# EAGLE design usb_hub_test (EAGLE 7.2.0)

## Sheet 1 of 7: USB Input
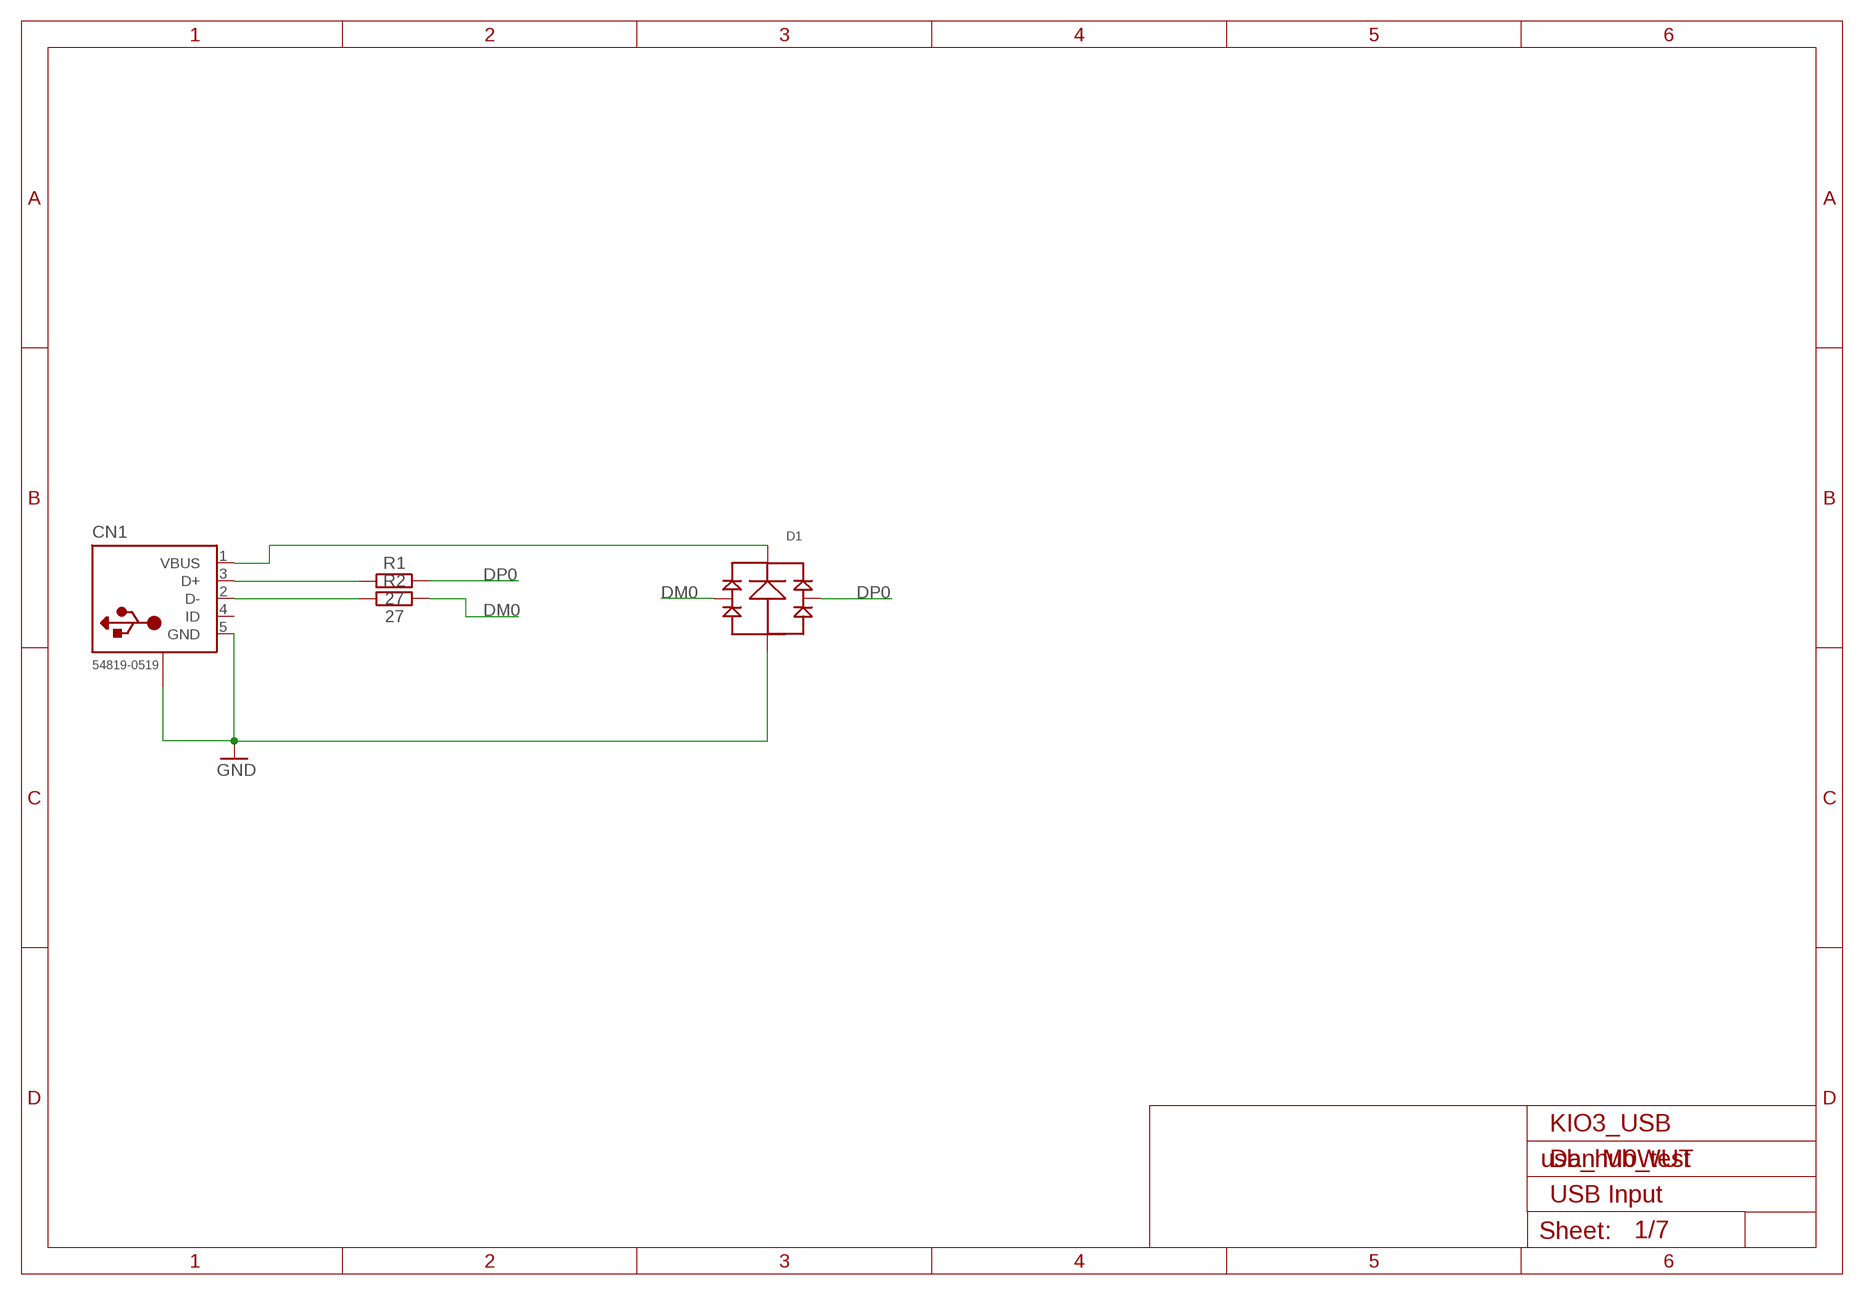
[diagram p0: schematic, sheet 1]

### Parts
CN1  54819-0519  USBMUSB  [CONN_AMP_MUSB_K152]
D1  D_ST_USBULC6  [UQFN6]
R1  27  R-EU_R0402  [R0402]
R2  27  R-EU_R0402  [R0402]

### Nets
D+_P: CN1.3(D+) R1.1
DM0: D1.1(LEFT) D1.6(LEFT) R2.2 ; also sheet 2
DP0: D1.3(RIGHT) D1.4(RIGHT) R1.2 ; also sheet 2
GND: CN1.5(GND) CN1.GND1(SHIELD) CN1.GND2(SHIELD) D1.2(GND) ; also sheet 2,3,4,5,6,7
N$20: CN1.2(D-) R2.1
VBUS: CN1.1(VBUS) D1.5(V+)
Unconnected: CN1.4(ID)

### Notes on the sheet
- KIO3_USB
- Dan M0WUT
- USB Input

## Sheet 2 of 7: USB Hub
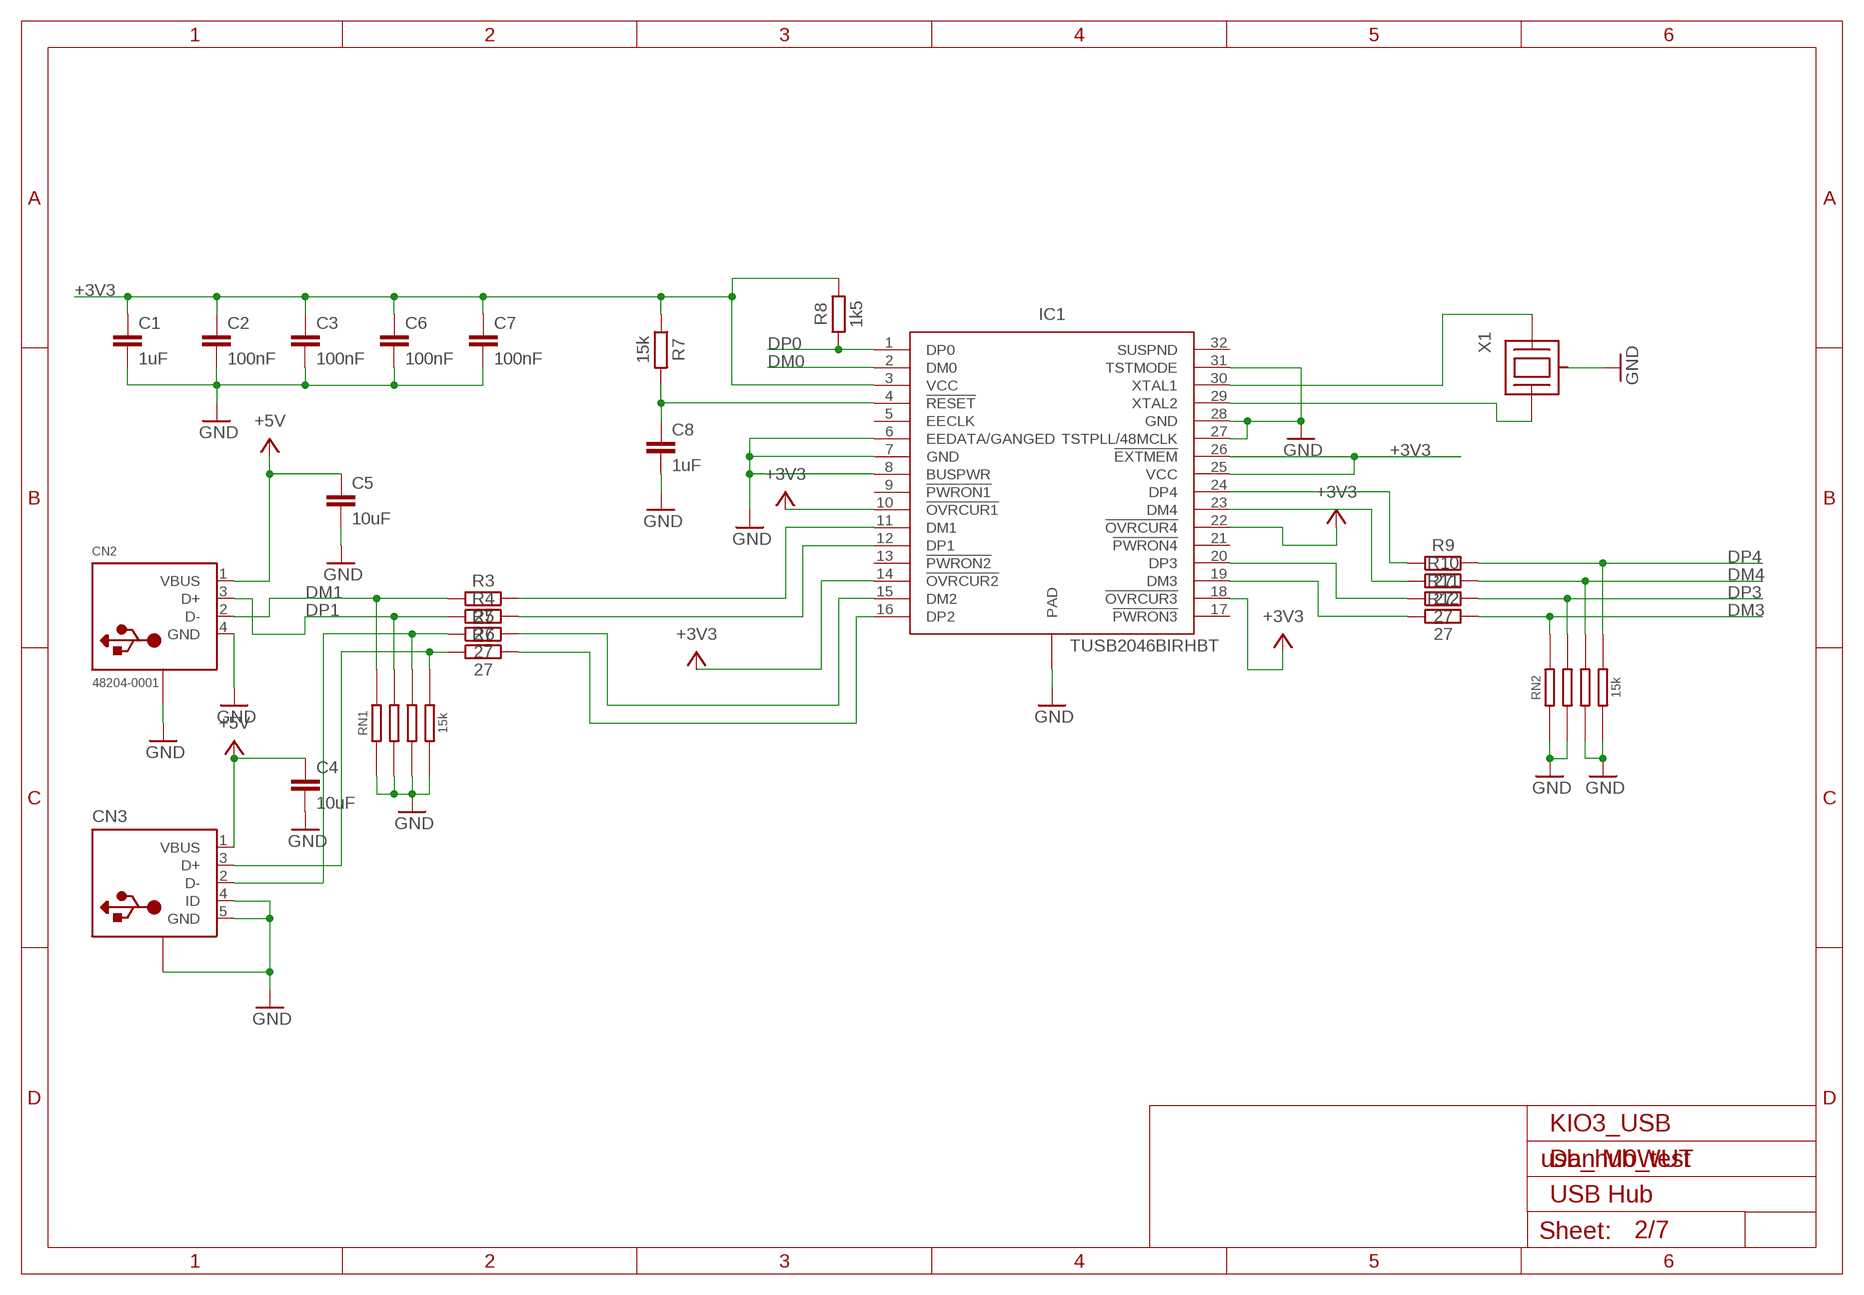
[diagram p1: schematic, sheet 2]

### Parts
C1  1uF  C-EUC0402  [C0402]
C2  100nF  C-EUC0402  [C0402]
C3  100nF  C-EUC0402  [C0402]
C4  10uF  C-EUC0805  [C0805]
C5  10uF  C-EUC0805  [C0805]
C6  100nF  C-EUC0402  [C0402]
C7  100nF  C-EUC0402  [C0402]
C8  1uF  C-EUC0402  [C0402]
CN2  48204-0001  USB_4WAY""  [CONN_USB_MOLEX_RA]
CN3  USBWURTH  [USB_MICROB_WURTH]
IC1  TUSB2046BIRHBT  TUSB2046BIRHBIRHB  [RHB_S-PQFP-N32]
R3  27  R-EU_R0402  [R0402]
R4  27  R-EU_R0402  [R0402]
R5  27  R-EU_R0402  [R0402]
R6  27  R-EU_R0402  [R0402]
R7  15k  R-EU_R0402  [R0402]
R8  1k5  R-EU_R0402  [R0402]
R9  27  R-EU_R0402  [R0402]
R10  27  R-EU_R0402  [R0402]
R11  27  R-EU_R0402  [R0402]
R12  27  R-EU_R0402  [R0402]
RN1  15k  R_BOURNS_CAY16-J4  [R_BOURNS_CAY16-J4]
RN2  15k  R_BOURNS_CAY16-J4  [R_BOURNS_CAY16-J4]
X1  XTAL_MURATA_3-PIN-RES  [XTAL_MURATA_3-PIN-RES]

### Nets
+3V3: C1.1 C2.1 C3.1 C6.1 C7.1 IC1.3(VCC) IC1.10(!OVRCUR1) IC1.14(!OVRCUR2) IC1.18(!OVRCUR3) IC1.22(!OVRCUR4) IC1.25(VCC) IC1.26(!EXTMEM) R7.1 R8.2 ; also sheet 3,4,6
+5V: C4.1 C5.1 CN2.1(VBUS) CN3.1(VBUS) ; also sheet 5,6,7
DM0: IC1.2(DM0) ; also sheet 1
DM1: CN2.2(D-) R3.1 RN1.1A
DM2: CN3.2(D-) R5.1 RN1.3A
DM3: R12.2 RN2.1A ; also sheet 3
DM4: R10.2 RN2.3A ; also sheet 3
DP0: IC1.1(DP0) R8.1 ; also sheet 1
DP1: CN2.3(D+) R4.1 RN1.2A
DP2: CN3.3(D+) R6.1 RN1.4A
DP3: R11.2 RN2.2A ; also sheet 3
DP4: R9.2 RN2.4A ; also sheet 3
GND: C1.2 C2.2 C3.2 C4.2 C5.2 C6.2 C7.2 C8.2 CN2.4(GND) CN2.P$2(SHIELD) CN2.P$3(SHIELD) CN2.P$4(SHIELD) CN2.P$5(SHIELD) CN3.4(ID) CN3.5(GND) CN3.GND1(SHIELD) CN3.GND2(SHIELD) CN3.GND3(SHIELD) CN3.GND4(SHIELD) IC1.6(EEDATA/GANGED) IC1.7(GND) IC1.8(BUSPWR) IC1.27(TSTPLL/48MCLK) IC1.28(GND) IC1.31(TSTMODE) IC1.EXP(PAD) RN1.1 RN1.2 RN1.3 RN1.4 RN2.1 RN2.2 RN2.3 RN2.4 X1.GND(CAN) ; also sheet 1,3,4,5,6,7
N$1: IC1.23(DM4) R10.1
N$3: IC1.24(DP4) R9.1
N$8: IC1.30(XTAL1) X1.1(XTAL1)
N$9: C8.1 IC1.4(!RESET) R7.2
N$10: IC1.29(XTAL2) X1.2(XTAL2)
N$11: IC1.15(DM2) R5.2
N$12: IC1.11(DM1) R3.2
N$13: IC1.12(DP1) R4.2
N$14: IC1.16(DP2) R6.2
N$16: IC1.20(DP3) R11.1
N$17: IC1.19(DM3) R12.1
Unconnected: IC1.5(EECLK) IC1.9(!PWRON1) IC1.13(!PWRON2) IC1.17(!PWRON3) IC1.21(!PWRON4) IC1.32(SUSPND)

### Notes on the sheet
- KIO3_USB
- Dan M0WUT
- USB Hub

## Sheet 3 of 7: FT2232
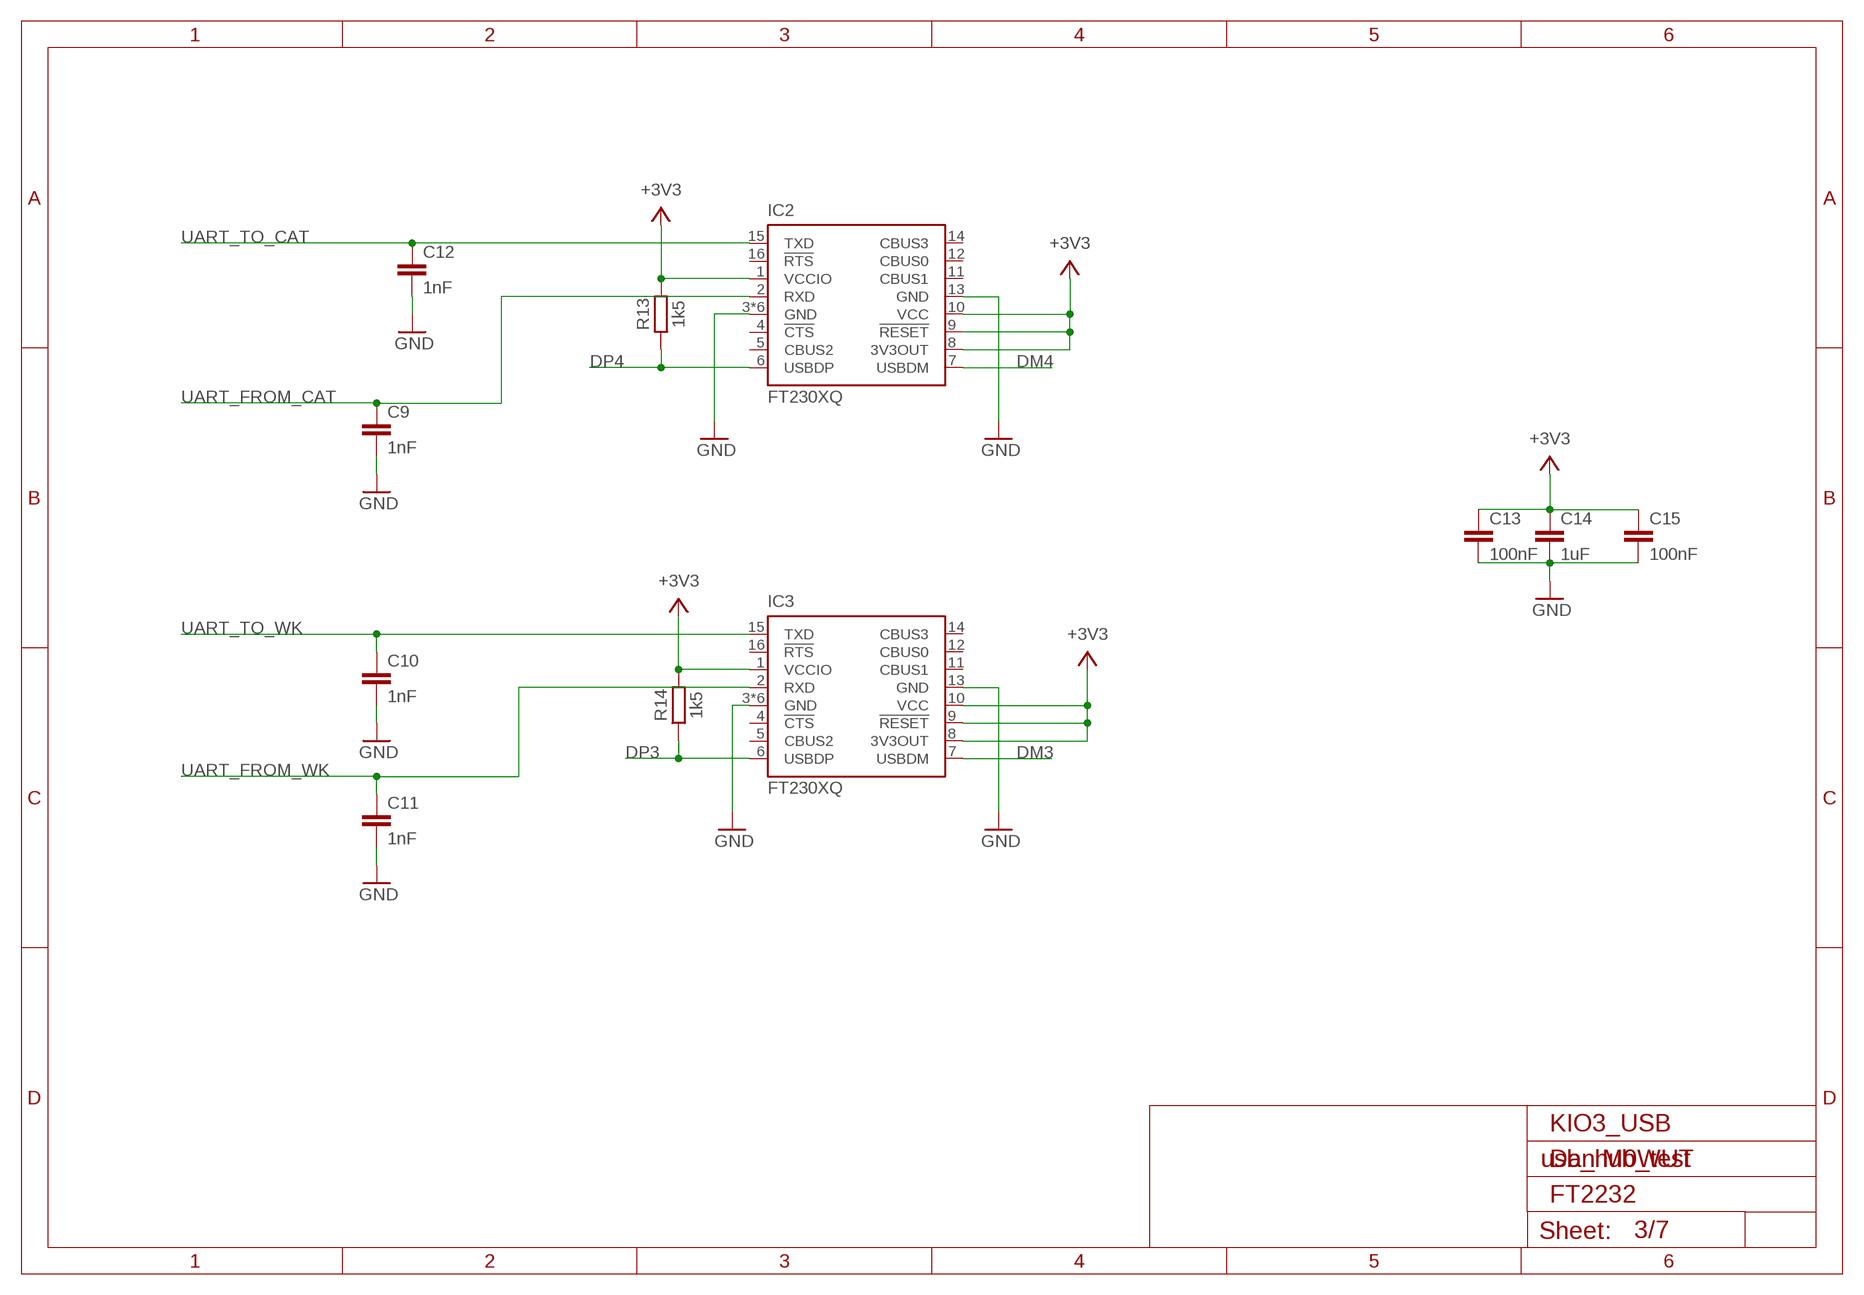
[diagram p2: schematic, sheet 3]

### Parts
C9  1nF  C-EUC0402  [C0402]
C10  1nF  C-EUC0402  [C0402]
C11  1nF  C-EUC0402  [C0402]
C12  1nF  C-EUC0402  [C0402]
C13  100nF  C-EUC0402  [C0402]
C14  1uF  C-EUC0402  [C0402]
C15  100nF  C-EUC0402  [C0402]
IC2  FT230XQ  [QFN16]
IC3  FT230XQ  [QFN16]
R13  1k5  R-EU_R0402  [R0402]
R14  1k5  R-EU_R0402  [R0402]

### Nets
+3V3: C13.1 C14.1 C15.1 IC2.1(VCCIO) IC2.8(3V3OUT) IC2.9(!RESET) IC2.10(VCC) IC3.1(VCCIO) IC3.8(3V3OUT) IC3.9(!RESET) IC3.10(VCC) R13.2 R14.2 ; also sheet 2,4,6
DM3: IC3.7(USBDM) ; also sheet 2
DM4: IC2.7(USBDM) ; also sheet 2
DP3: IC3.6(USBDP) R14.1 ; also sheet 2
DP4: IC2.6(USBDP) R13.1 ; also sheet 2
GND: C9.2 C10.2 C11.2 C12.2 C13.2 C14.2 C15.2 IC2.3(GND) IC2.13(GND) IC2.P$1(GND) IC2.P$2(GND) IC2.P$3(GND) IC2.P$4(GND) IC2.TAB(GND) IC3.3(GND) IC3.13(GND) IC3.P$1(GND) IC3.P$2(GND) IC3.P$3(GND) IC3.P$4(GND) IC3.TAB(GND) ; also sheet 1,2,4,5,6,7
UART_FROM_CAT: C9.1 IC2.2(RXD) ; also sheet 4
UART_FROM_WK: C11.1 IC3.2(RXD) ; also sheet 4
UART_TO_CAT: C12.1 IC2.15(TXD) ; also sheet 4
UART_TO_WK: C10.1 IC3.15(TXD) ; also sheet 4
Unconnected: IC2.4(!CTS) IC2.5(CBUS2) IC2.11(CBUS1) IC2.12(CBUS0) IC2.14(CBUS3) IC2.16(!RTS) IC3.4(!CTS) IC3.5(CBUS2) IC3.11(CBUS1) IC3.12(CBUS0) IC3.14(CBUS3) IC3.16(!RTS)

### Notes on the sheet
- KIO3_USB
- Dan M0WUT
- FT2232

## Sheet 4 of 7: PIC
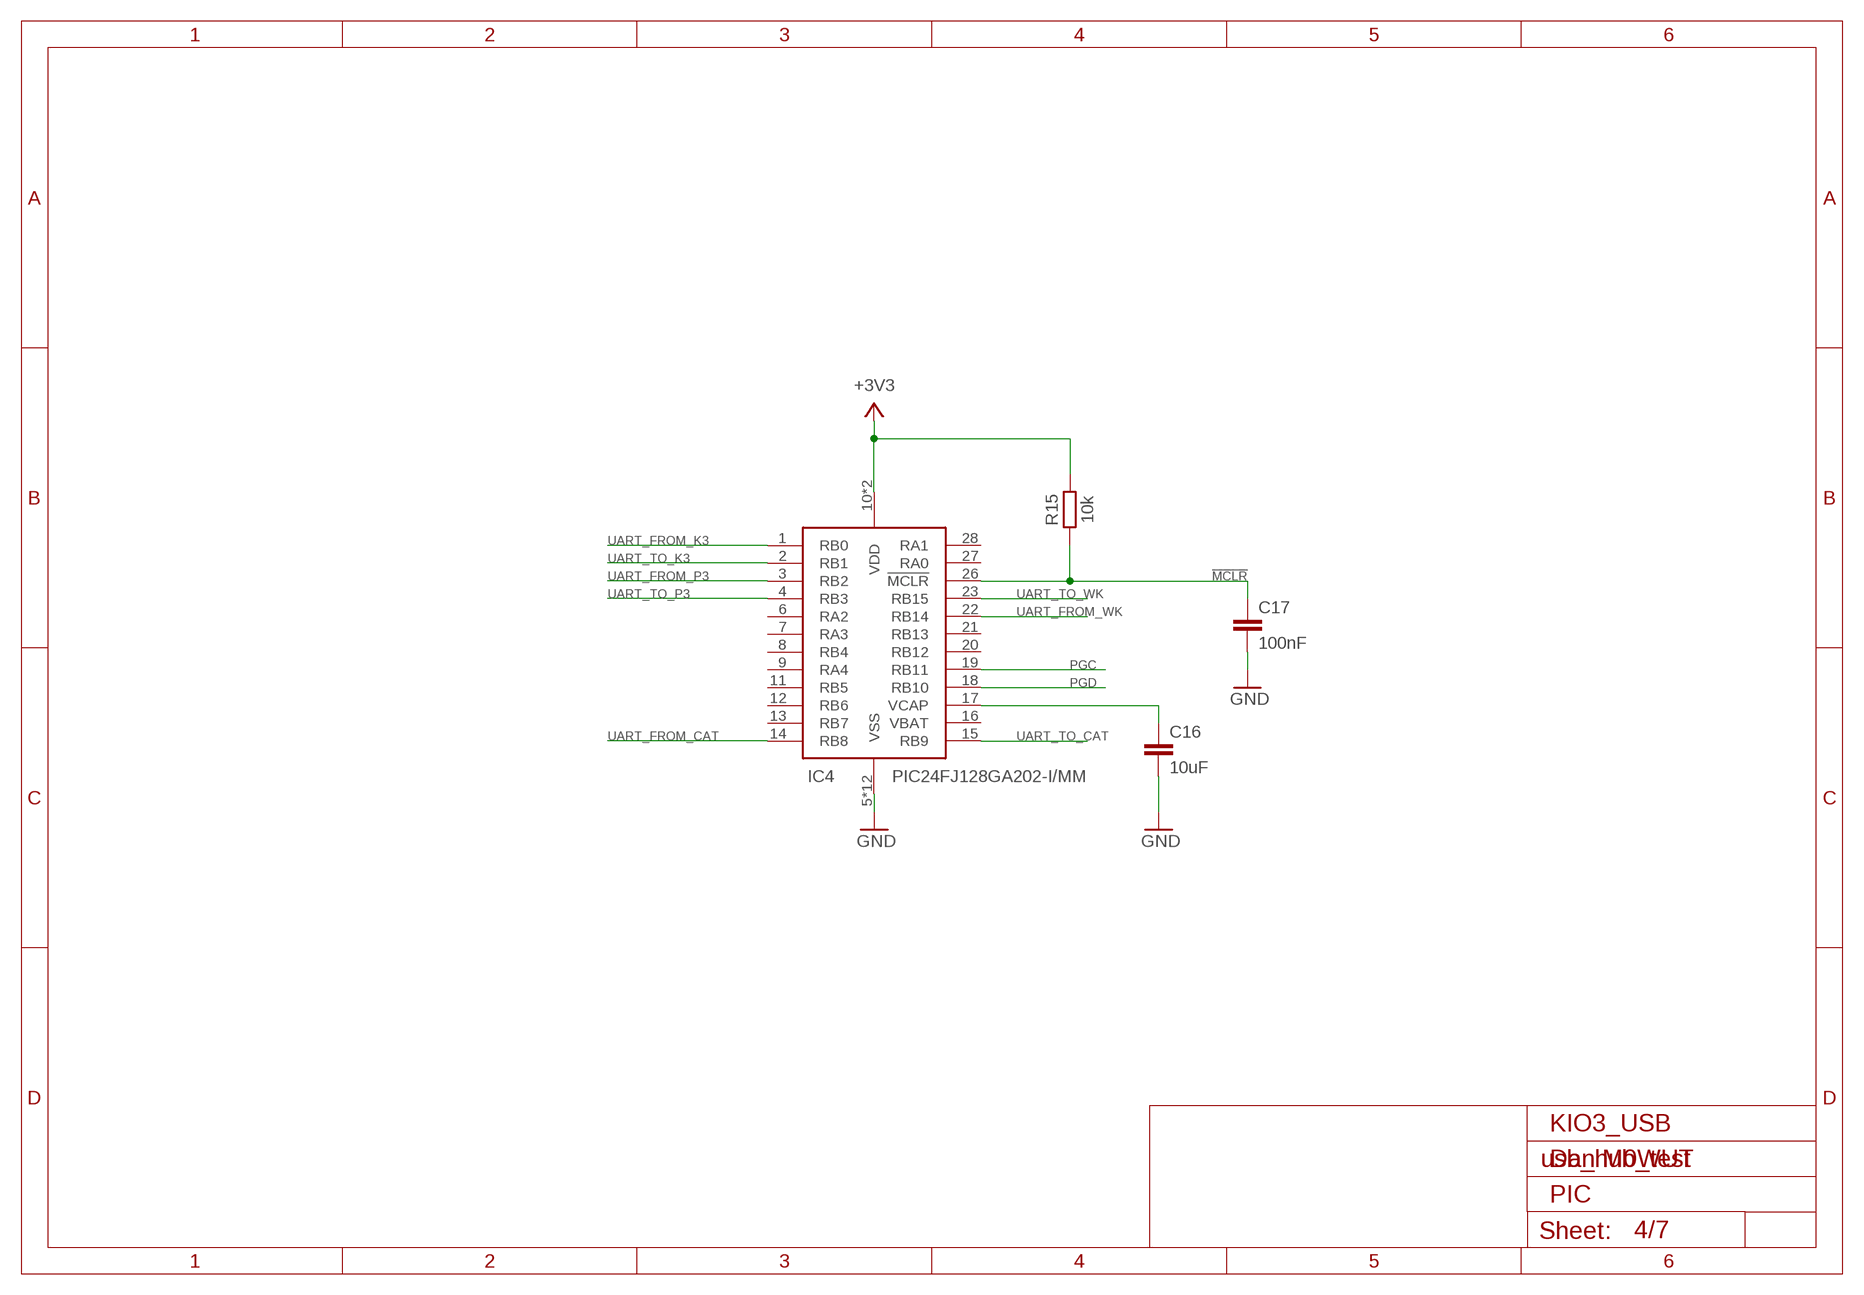
[diagram p3: schematic, sheet 4]

### Parts
C16  10uF  C-EUC0805  [C0805]
C17  100nF  C-EUC0402  [C0402]
IC4  PIC24FJ128GA202-I/MM  [QFN28-ML_6X6MM]
R15  10k  R-EU_R0402  [R0402]

### Nets
!MCLR: C17.1 IC4.26(!MCLR) R15.1
+3V3: IC4.10(VDD) IC4.25(VDD) R15.2 ; also sheet 2,3,6
GND: C16.2 C17.2 IC4.5(VSS) IC4.24(VSS) IC4.EXP(VSS) IC4.P$1(VSS) IC4.P$2(VSS) IC4.P$3(VSS) IC4.P$4(VSS) IC4.P$5(VSS) IC4.P$6(VSS) IC4.P$7(VSS) IC4.P$9(VSS) IC4.P$10(VSS) ; also sheet 1,2,3,5,6,7
N$2: C16.1 IC4.17(VCAP)
PGC: IC4.19(RB11)
PGD: IC4.18(RB10)
UART_FROM_CAT: IC4.14(RB8) ; also sheet 3
UART_FROM_K3: IC4.1(RB0) ; also sheet 6
UART_FROM_P3: IC4.3(RB2) ; also sheet 7
UART_FROM_WK: IC4.22(RB14) ; also sheet 3
UART_TO_CAT: IC4.15(RB9) ; also sheet 3
UART_TO_K3: IC4.2(RB1) ; also sheet 6
UART_TO_P3: IC4.4(RB3) ; also sheet 7
UART_TO_WK: IC4.23(RB15) ; also sheet 3
Unconnected: IC4.6(RA2) IC4.7(RA3) IC4.8(RB4) IC4.9(RA4) IC4.11(RB5) IC4.12(RB6) IC4.13(RB7) IC4.16(VBAT) IC4.20(RB12) IC4.21(RB13) IC4.27(RA0) IC4.28(RA1)

### Notes on the sheet
- KIO3_USB
- Dan M0WUT
- PIC

## Sheet 5 of 7: Connectors
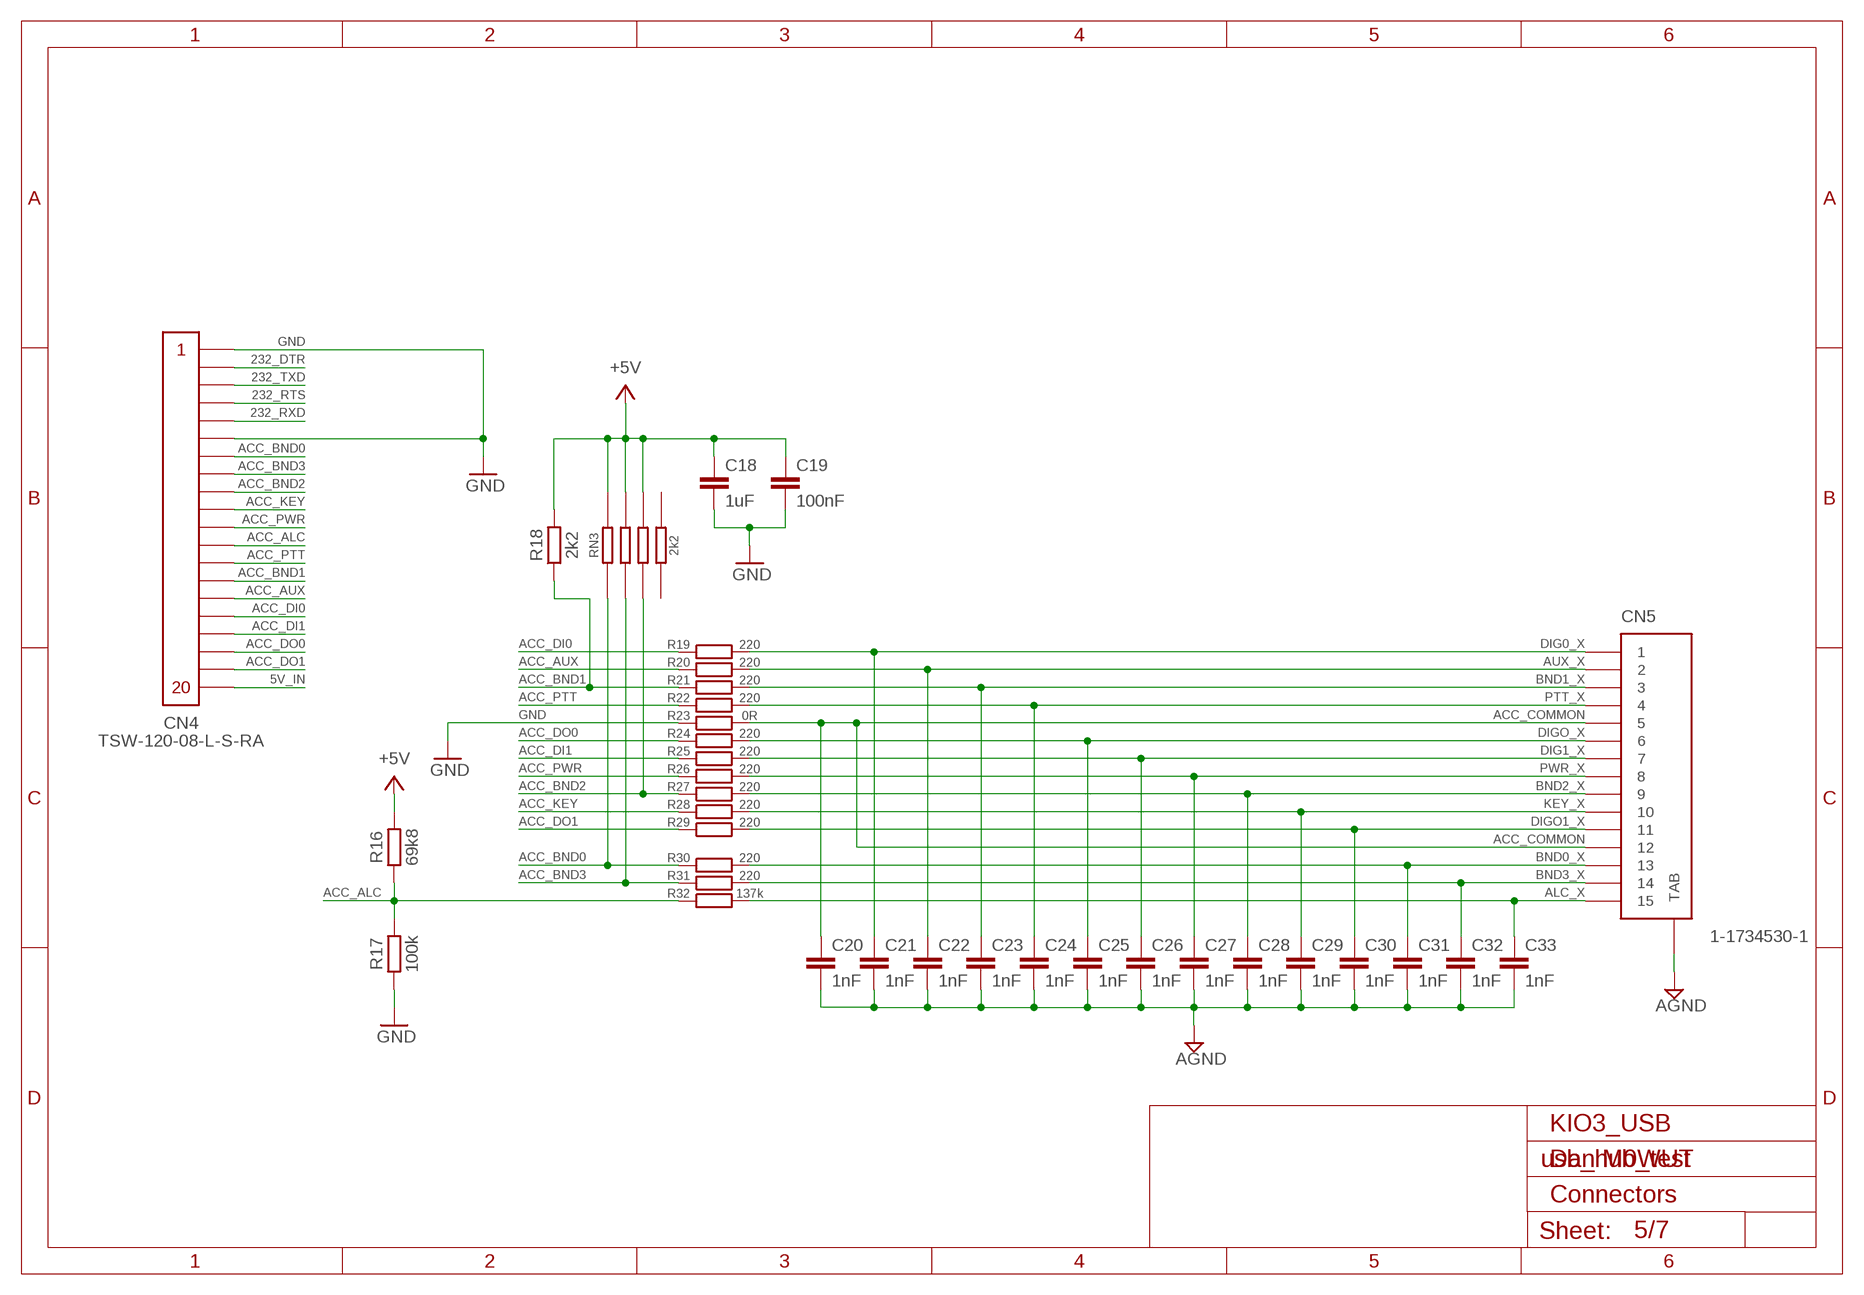
[diagram p4: schematic, sheet 5]

### Parts
C18  1uF  C-EUC0402  [C0402]
C19  100nF  C-EUC0402  [C0402]
C20  1nF  C-EUC0402  [C0402]
C21  1nF  C-EUC0402  [C0402]
C22  1nF  C-EUC0402  [C0402]
C23  1nF  C-EUC0402  [C0402]
C24  1nF  C-EUC0402  [C0402]
C25  1nF  C-EUC0402  [C0402]
C26  1nF  C-EUC0402  [C0402]
C27  1nF  C-EUC0402  [C0402]
C28  1nF  C-EUC0402  [C0402]
C29  1nF  C-EUC0402  [C0402]
C30  1nF  C-EUC0402  [C0402]
C31  1nF  C-EUC0402  [C0402]
C32  1nF  C-EUC0402  [C0402]
C33  1nF  C-EUC0402  [C0402]
CN4  TSW-120-08-L-S-RA  CONN_0.1"_1X20  [CONN_0.1_1X20]
CN5  1-1734530-1  CONN_TE_DB-HD15  [CONN_TE_DE-HD15]
R16  69k8  R-EU_R0402  [R0402]
R17  100k  R-EU_R0402  [R0402]
R18  2k2  R-EU_R0402  [R0402]
R19  220  R-EU_R0402  [R0402]
R20  220  R-EU_R0402  [R0402]
R21  220  R-EU_R0402  [R0402]
R22  220  R-EU_R0402  [R0402]
R23  0R  R-EU_R0402  [R0402]
R24  220  R-EU_R0402  [R0402]
R25  220  R-EU_R0402  [R0402]
R26  220  R-EU_R0402  [R0402]
R27  220  R-EU_R0402  [R0402]
R28  220  R-EU_R0402  [R0402]
R29  220  R-EU_R0402  [R0402]
R30  220  R-EU_R0402  [R0402]
R31  220  R-EU_R0402  [R0402]
R32  137k  R-EU_R0402  [R0402]
RN3  2k2  R_BOURNS_CAY16-J4  [R_BOURNS_CAY16-J4]

### Nets
5V_IN: CN4.P$20 ; also sheet 6
232_DTR: CN4.P$2
232_RTS: CN4.P$4
232_RXD: CN4.P$5 ; also sheet 6
232_TXD: CN4.P$3 ; also sheet 6
+5V: C18.1 C19.1 R16.2 R18.2 RN3.1 RN3.2 RN3.3 ; also sheet 2,6,7
ACC_ALC: CN4.P$12 R16.1 R17.2 R32.1
ACC_AUX: CN4.P$15 R20.1
ACC_BND0: CN4.P$7 R30.1 RN3.1A
ACC_BND1: CN4.P$14 R18.1 R21.1
ACC_BND2: CN4.P$9 R27.1 RN3.3A
ACC_BND3: CN4.P$8 R31.1 RN3.2A
ACC_COMMON: C20.1 CN5.5 CN5.12 R23.2
ACC_DI0: CN4.P$16 R19.1
ACC_DI1: CN4.P$17 R25.1
ACC_DO0: CN4.P$18 R24.1
ACC_DO1: CN4.P$19 R29.1
ACC_KEY: CN4.P$10 R28.1
ACC_PTT: CN4.P$13 R22.1
ACC_PWR: CN4.P$11 R26.1
AGND: C20.2 C21.2 C22.2 C23.2 C24.2 C25.2 C26.2 C27.2 C28.2 C29.2 C30.2 C31.2 C32.2 C33.2 CN5.16(TAB) CN5.17(TAB) ; also sheet 6,7
ALC_X: C33.1 CN5.15 R32.2
AUX_X: C22.1 CN5.2 R20.2
BND0_X: C31.1 CN5.13 R30.2
BND1_X: C23.1 CN5.3 R21.2
BND2_X: C28.1 CN5.9 R27.2
BND3_X: C32.1 CN5.14 R31.2
DIG0_X: C21.1 CN5.1 R19.2
DIG1_X: C26.1 CN5.7 R25.2
DIGO1_X: C30.1 CN5.11 R29.2
DIGO_X: C25.1 CN5.6 R24.2
GND: C18.2 C19.2 CN4.P$1 CN4.P$6 R17.1 R23.1 ; also sheet 1,2,3,4,6,7
KEY_X: C29.1 CN5.10 R28.2
PTT_X: C24.1 CN5.4 R22.2
PWR_X: C27.1 CN5.8 R26.2
Unconnected: RN3.4 RN3.4A

### Notes on the sheet
- KIO3_USB
- Dan M0WUT
- Connectors

## Sheet 6 of 7
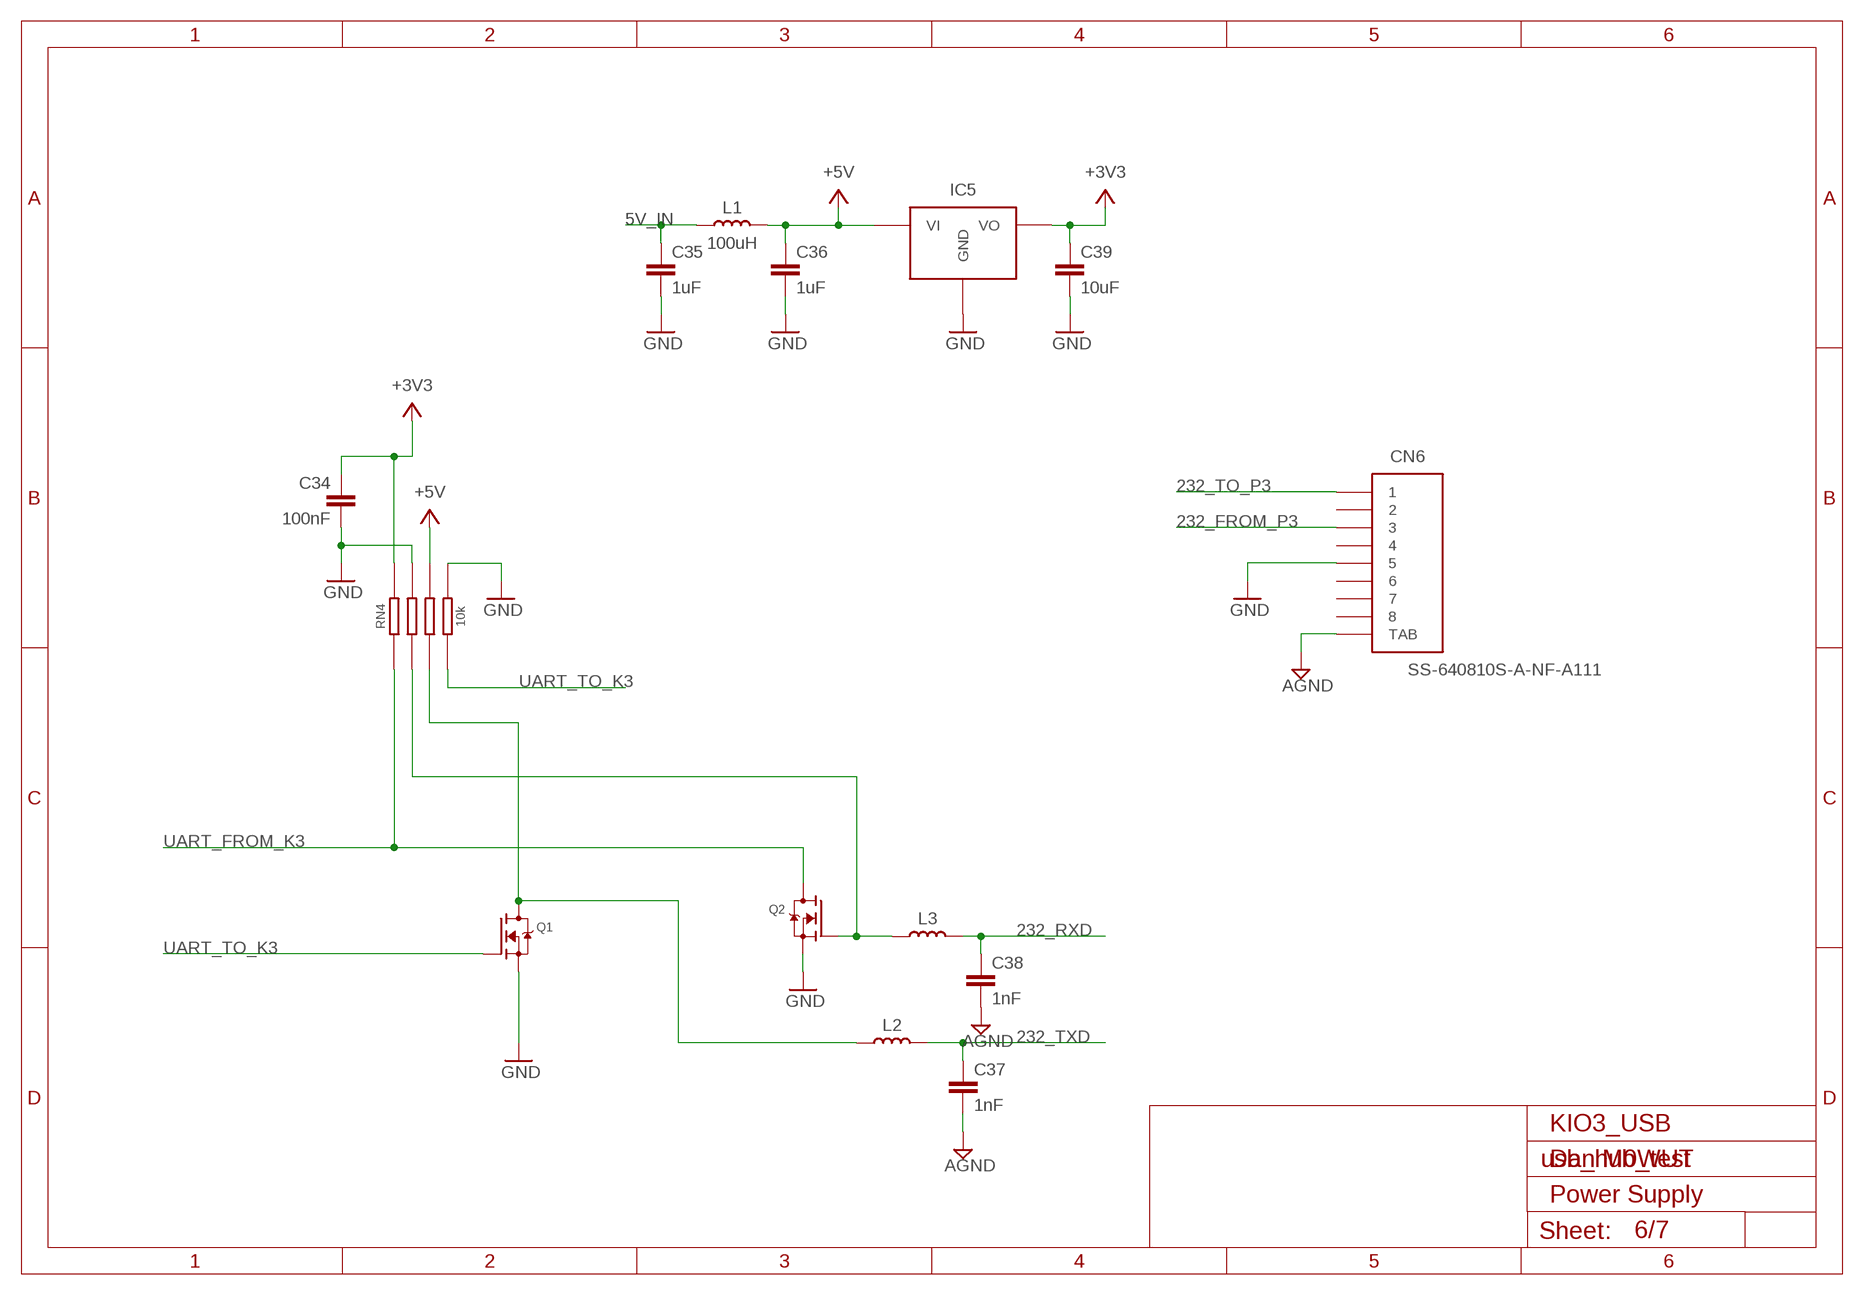
[diagram p5: schematic, sheet 6]

### Parts
C34  100nF  C-EUC0402  [C0402]
C35  1uF  C-EUC0402  [C0402]
C36  1uF  C-EUC0402  [C0402]
C37  1nF  C-EUC0402  [C0402]
C38  1nF  C-EUC0402  [C0402]
C39  10uF  C-EUC0805  [C0805]
CN6  SS-640810S-A-NF-A111  CONN_RJ45_SHIELDEDSTEWART_SHORTER  [CONN_STEWART_RJ45_1]
IC5  MCP1700  [SOT23]
L1  100uH  INDUCTOR  [R0805]
L2  INDUCTOR  [R0805]
L3  INDUCTOR  [R0805]
Q1  MOSFET-NREFLOW  [SOT23]
Q2  MOSFET-NREFLOW  [SOT23]
RN4  10k  R_BOURNS_CAY16-J4  [R_BOURNS_CAY16-J4]

### Nets
5V_IN: C35.1 L1.1 ; also sheet 5
232_FROM_P3: CN6.3 ; also sheet 7
232_RXD: C38.1 L3.2 ; also sheet 5
232_TO_P3: CN6.1 ; also sheet 7
232_TXD: C37.1 L2.2 ; also sheet 5
+3V3: C34.1 C39.1 IC5.BOTTOM_RIGHT(VO) RN4.1A ; also sheet 2,3,4
+5V: C36.1 IC5.TOP(VI) L1.2 RN4.3A ; also sheet 2,5,7
AGND: C37.2 C38.2 CN6.TAB CN6.TAB1(TAB) ; also sheet 5,7
ASDF: L2.1 Q1.3(D) RN4.3
GND: C34.2 C35.2 C36.2 C39.2 CN6.5 IC5.BOTTOM_LEFT(GND) Q1.2(S) Q2.2(S) RN4.2A RN4.4A ; also sheet 1,2,3,4,5,7
SADF: L3.1 Q2.1(G) RN4.2
UART_FROM_K3: Q2.3(D) RN4.1 ; also sheet 4
UART_TO_K3: Q1.1(G) RN4.4 ; also sheet 4
Unconnected: CN6.2 CN6.4 CN6.6 CN6.7 CN6.8

### Notes on the sheet
- KIO3_USB
- Dan M0WUT
- Power Supply

## Sheet 7 of 7
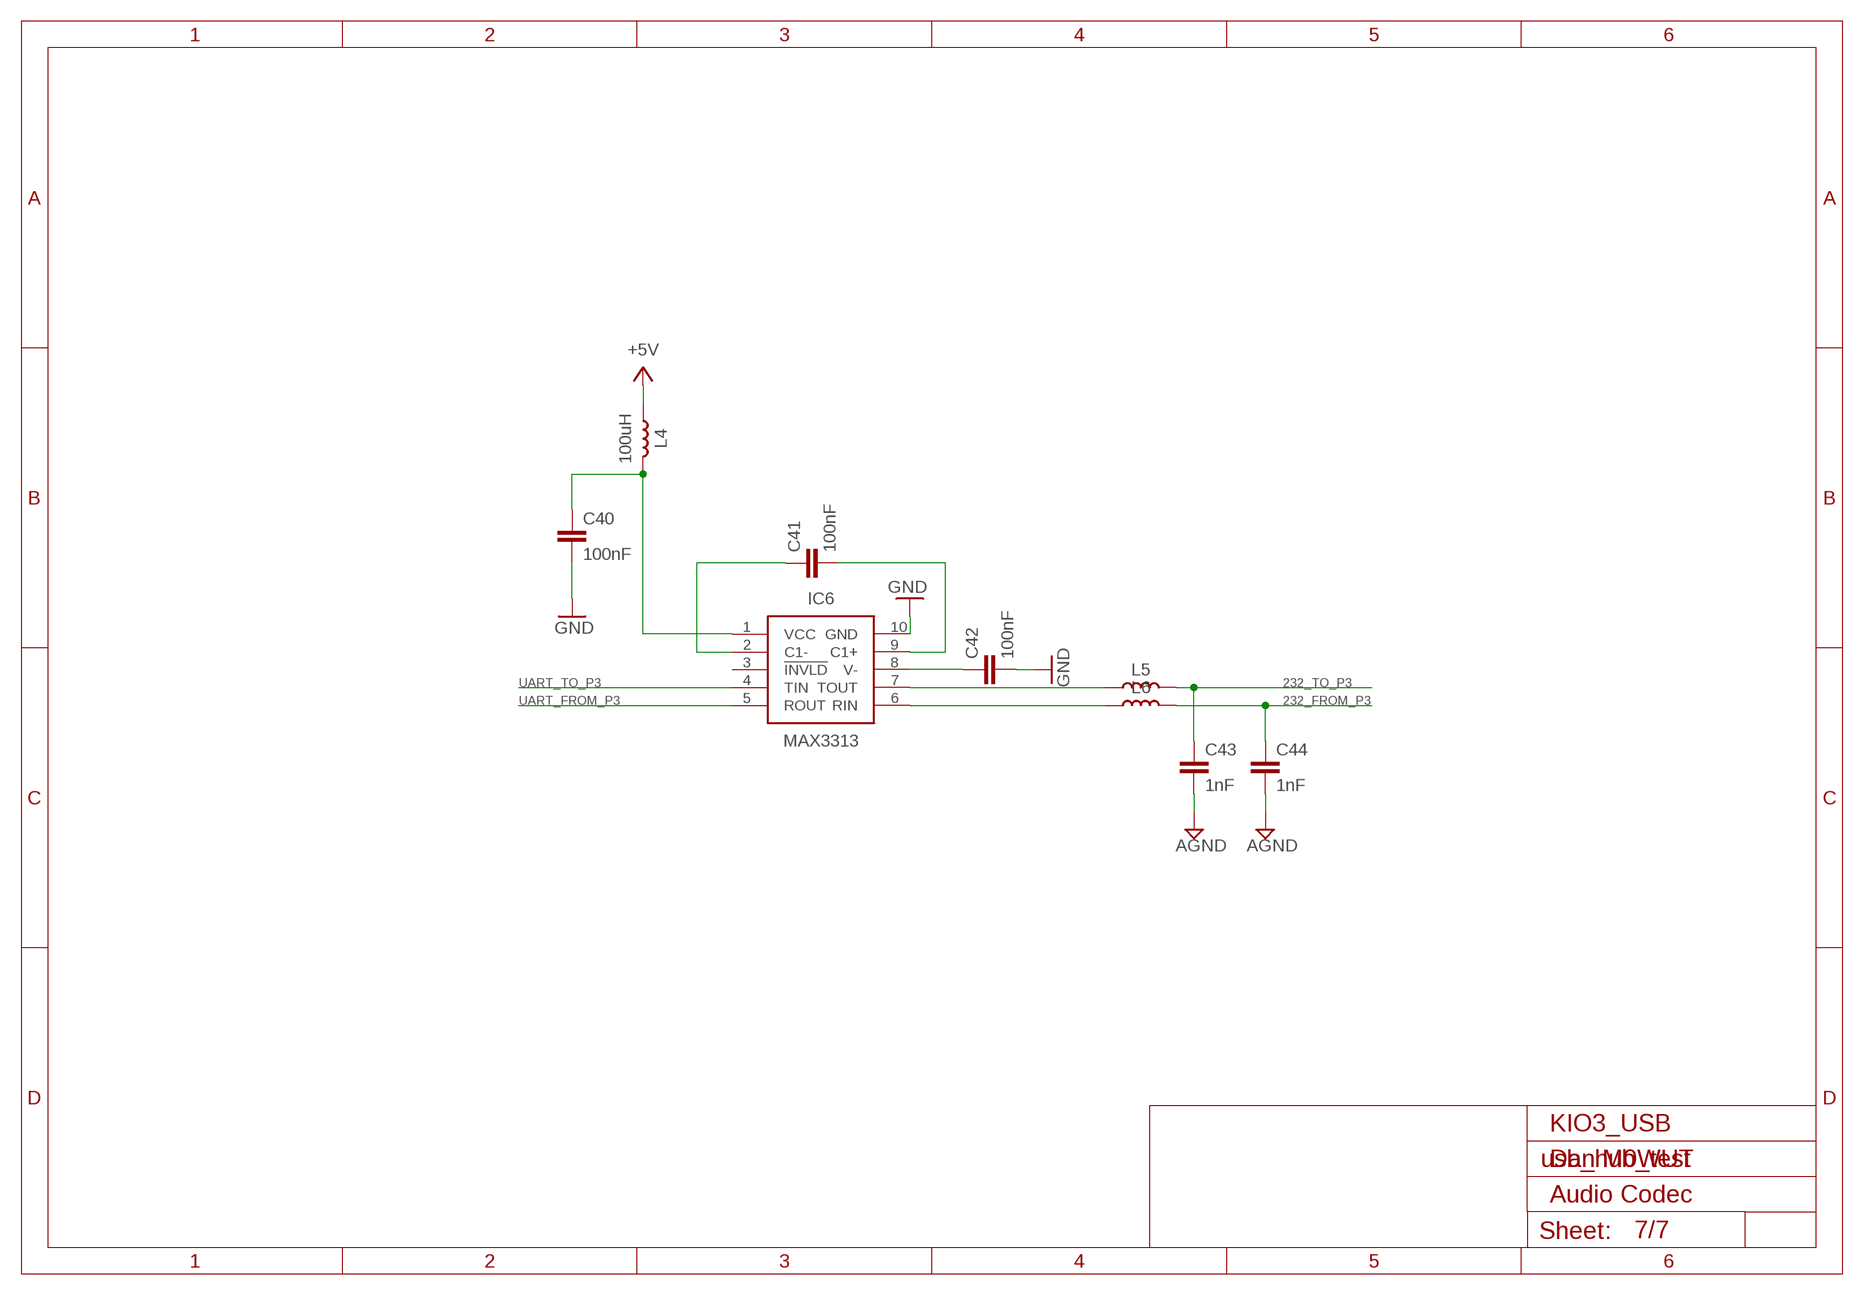
[diagram p6: schematic, sheet 7]

### Parts
C40  100nF  C-EUC0402  [C0402]
C41  100nF  C-EUC0402  [C0402]
C42  100nF  C-EUC0402  [C0402]
C43  1nF  C-EUC0402  [C0402]
C44  1nF  C-EUC0402  [C0402]
IC6  IC_MAX3313  [IC_UMAX10]
L4  100uH  INDUCTOR  [R0805]
L5  INDUCTOR  [R0805]
L6  INDUCTOR  [R0805]

### Nets
232_FROM_P3: C44.1 L6.2 ; also sheet 6
232_TO_P3: C43.1 L5.2 ; also sheet 6
+5V: L4.1 ; also sheet 2,5,6
AGND: C43.2 C44.2 ; also sheet 5,6
GND: C40.2 C42.2 IC6.10(GND) ; also sheet 1,2,3,4,5,6
N$4: C40.1 IC6.1(VCC) L4.2
N$6: C41.1 IC6.2(C1-)
N$7: C41.2 IC6.9(C1+)
N$15: C42.1 IC6.8(V-)
UART_FROM_P3: IC6.5(ROUT) ; also sheet 4
UART_TO_P3: IC6.4(TIN) ; also sheet 4
WTRE: IC6.7(TOUT) L5.1
Y5W4: IC6.6(RIN) L6.1
Unconnected: IC6.3(!INVLD)

### Notes on the sheet
- KIO3_USB
- Dan M0WUT
- Audio Codec

## Library data of the parts
C1-C44 = rcl:C-EU: CAPACITOR, European symbol
CN1 CN3 = m0wut:USB: USB Connectors USBMINIB - Surface Mount Female Mini-B USB Connector 4UConnector: 06564 By microbuilder.eu Thru-hole RA Female Mini-B USB Connector 4UConnector: 18732 By ladyada.net
CN2 = m0wut:USB_4WAY
CN4 = m0wut:CONN_0.1"_1X20
CN5 = m0wut:CONN_TE_DB-HD15: TE: 1-1734530-1 Farnell: 2293881
CN6 = m0wut:CONN_RJ45_SHIELDED
D1 = m0wut:D_ST_USBULC6
IC1 = texas:TUSB2046BIRHB: 4-PORT HUB FOR THE UNIVERSAL SERIAL BUS WITH OPTIONAL SERIAL EEPROM INTERFACE Source: http://focus.ti.com/lit/ds/symlink/tusb2046b.pdf; MPN: TUSB2046BIRHBT; OC_FARNELL: 1610201; OC_NEWARK: 14N8499
IC2 IC3 = ftdichip:FT230X: USB to BASIC UART IC Auto generated by make-symbol-device-package-bsdl.ulp Rev. 43 Source: Data sheet <http://www.ftdichip.com/Support/Documents/DataSheets/ICs/DS_FT230X.pdf>
IC4 = m0wut:PIC24FJ128GA202-I/MM
IC5 = m0wut:MCP1700
IC6 = m0wut:IC_MAX3313
L1-L6 = m0wut:INDUCTOR
Q1 Q2 = adafruit:MOSFET-N: N-Channel Mosfet 2N7002E - 60V 260mA SOT23 [Digikey: 2N7002ET1GOSTR-ND] - REEL BSH103 - 30V 850mA SOT23 [Digikey: 568-5013-1-ND]
R1-R32 = rcl:R-EU_: RESISTOR, European symbol
RN1-RN4 = m0wut:R_BOURNS_CAY16-J4
X1 = m0wut:XTAL_MURATA_3-PIN-RES: Murata CSTCR6M00G53Z-R0 Farnell: 2470365

## Net classes
1 USB: width 0.229 mm, clearance 0.127 mm

## Board
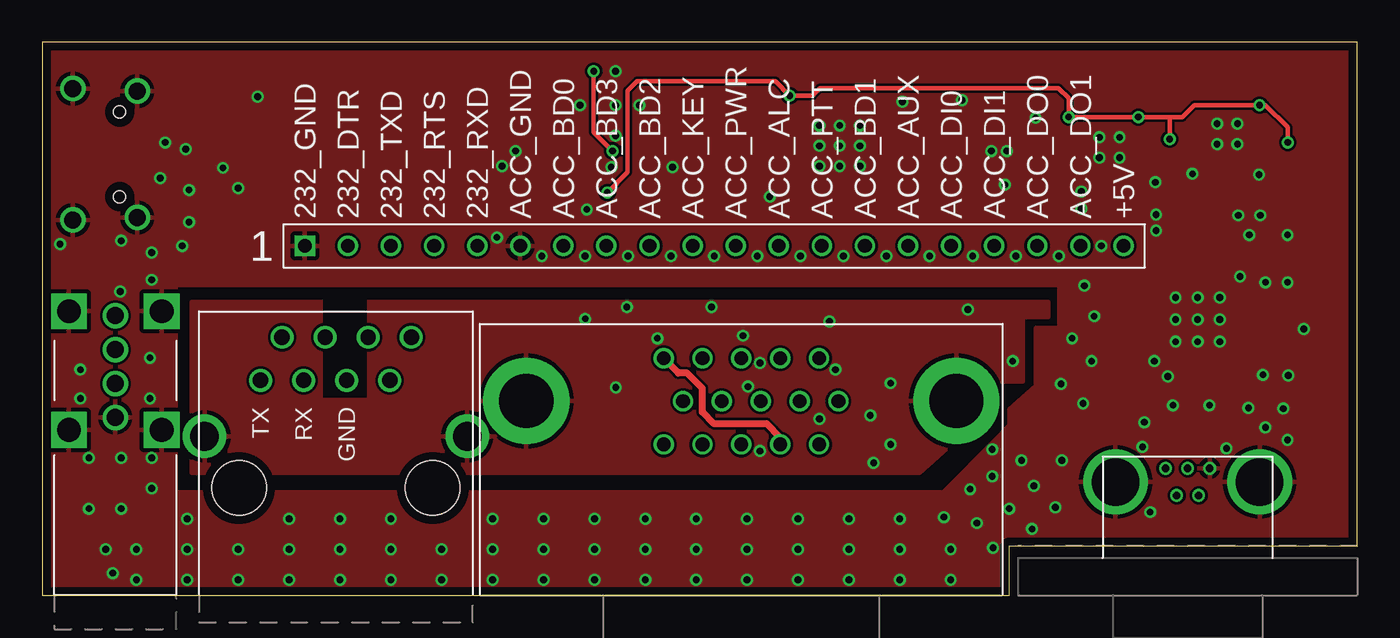
[diagram p7: board, top side]
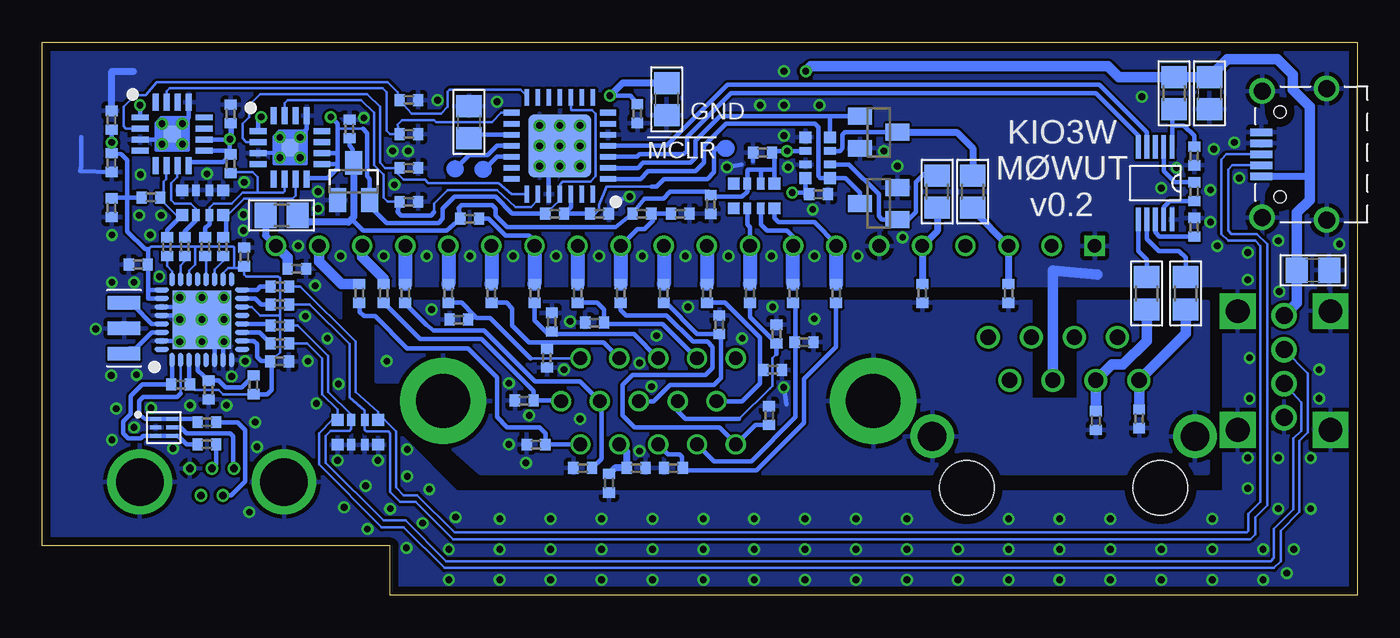
[diagram p8: board, bottom side, seen from below]

Size 77.5 x 32.6 mm. Coordinates in mm from the lower left corner, seen from the top.
Outline: 0,0 57,0 57,2.9 77.5,2.9 77.5,32.6 0,32.6 0,0
Copper layers (1*16): Top 0.035mm / dielectric 1.6mm / Bottom 0.035mm
Design rules "Elecrow_2-layer_PCB_eagle_rule": minimum track width 6mil, minimum drill 12mil, track to track 6mil, track to pad 6mil, pad to pad 6mil, via to via 8mil, smd to smd 0mil, copper to edge 20mil, drill to drill 10mil, minimum pad ring 6mil, minimum via ring 6mil, stop-mask expansion 0mil, vias tented up to drill 100mil, thermal gap 10mil
tRestrict: area 16.6,11.6 to 19.1,17.4
bRestrict: area 66,15.9 to 67.4,16.1; area 66.5,13.8 to 67.4,14; area 66.3,14.5 to 69.8,18; area 70.2,16.6 to 70.7,16.9; area 16.6,11.6 to 19.1,17.4; area 5.3,26.8 to 5.9,27.1; 3 lines

### Footprints (pad centres in the part's own frame; a part is rotated, then mirrored left to right if it is on the bottom)
C0402 = smd 0.6 x 0.7: 1 -0.55,0; 2 0.55,0
C0805 = smd 1.3 x 1.5: 1 -0.95,0; 2 0.95,0
CONN_AMP_MUSB_K152 = drill 0.45: 1 -1.3,4.58; 2 -0.65,2.98; 3 0,4.58; 4 0.65,2.98; 5 1.3,4.58 | drill 2.8: GND1 -4.25,3.78; GND2 4.25,3.78
CONN_USB_MOLEX_RA = drill 1: 1 0,16.48; 2 0,14.48; 3 0,12.48; 4 0,10.48 | drill 1.4 square: P$2 2.735,9.75; P$3 -2.735,9.75; P$4 -2.735,16.75; P$5 2.735,16.75
USB_MICROB_WURTH = smd 0.45 x 1.3: 1 -1.3,5.65; 2 -0.65,5.65; 3 0,5.65; 4 0.65,5.65; 5 1.3,5.65 | drill 1: GND1 -3.875,1.8; GND2 3.875,1.8; GND3 3.725,5.6; GND4 -3.725,5.6 | hole 0.7: -2.5,4.55; 2.5,4.55
CONN_0.1_1X20 = drill 0.8 square: P$1 0,0 | drill 0.8: P$2 2.54,0; P$3 5.08,0; P$4 7.62,0; P$5 10.16,0; P$6 12.7,0; P$7 15.24,0; P$8 17.78,0; P$9 20.32,0; P$10 22.86,0; P$11 25.4,0; P$12 27.94,0; P$13 30.48,0; P$14 33.02,0; P$15 35.56,0; P$16 38.1,0; P$17 40.64,0; P$18 43.18,0; P$19 45.72,0; P$20 48.26,0
CONN_TE_DE-HD15 = drill 0.8: 1 4.58,13.97; 2 2.29,13.97; 3 0,13.97; 4 -2.29,13.97; 5 -4.58,13.97; 6 5.725,11.43; 7 3.435,11.43; 8 1.145,11.43; 9 -1.145,11.43; 10 -3.435,11.43; 11 4.58,8.89; 12 2.29,8.89; 13 0,8.89; 14 -2.29,8.89; 15 -4.58,8.89 | drill 3.2 pad 5.08: 16 12.675,11.45; 17 -12.675,11.45
CONN_STEWART_RJ45_1 = drill 0.9: 1 -4.445,12.67; 2 -3.175,15.21; 3 -1.905,12.67; 4 -0.635,15.21; 5 0.635,12.67; 6 1.905,15.21; 7 3.175,12.67; 8 4.445,15.21 | drill 1.7: TAB -7.745,9.37; TAB1 7.745,9.37 | hole 3.2: -5.715,6.32; 5.715,6.32
UQFN6 = smd 0.25 x 0.65: 1 -0.5,-0.475; 2 0,-0.475; 3 0.5,-0.475; 4 0.5,0.475; 5 0,0.475; 6 -0.5,0.475
RHB_S-PQFP-N32 = smd 0.85 x 0.3: 1 -2.375,1.75; 2 -2.375,1.25; 3 -2.375,0.75; 4 -2.375,0.25; 5 -2.375,-0.25; 6 -2.375,-0.75; 7 -2.375,-1.25; 8 -2.375,-1.75; 17 2.375,-1.75; 18 2.375,-1.25; 19 2.375,-0.75; 20 2.375,-0.25; 21 2.375,0.25; 22 2.375,0.75; 23 2.375,1.25; 24 2.375,1.75 | smd 0.3 x 0.85: 9 -1.75,-2.375; 10 -1.25,-2.375; 11 -0.75,-2.375; 12 -0.25,-2.375; 13 0.25,-2.375; 14 0.75,-2.375; 15 1.25,-2.375; 16 1.75,-2.375; 25 1.75,2.375; 26 1.25,2.375; 27 0.75,2.375; 28 0.25,2.375; 29 -0.25,2.375; 30 -0.75,2.375; 31 -1.25,2.375; 32 -1.75,2.375 | smd 3.45 x 3.45: EXP 0,0
QFN16 = smd 1 x 0.35: 1 -1.875,0.975; 2 -1.875,0.325; 3 -1.875,-0.325; 4 -1.875,-0.975; 9 1.875,-0.975; 10 1.875,-0.325; 11 1.875,0.325; 12 1.875,0.975 | smd 0.35 x 1: 5 -0.975,-1.875; 6 -0.325,-1.875; 7 0.325,-1.875; 8 0.975,-1.875; 13 0.975,1.875; 14 0.325,1.875; 15 -0.325,1.875; 16 -0.975,1.875 | drill 0.4 pad 0.61: P$1 -0.6,-0.6; P$2 0.6,-0.6; P$3 0.6,0.6; P$4 -0.6,0.6 | smd 1 x 1: TAB 0,0
QFN28-ML_6X6MM = smd 1 x 0.35: 1 -2.85,1.95; 2 -2.85,1.3; 3 -2.85,0.65; 4 -2.85,0; 5 -2.85,-0.65; 6 -2.85,-1.3; 7 -2.85,-1.95; 15 2.85,-1.95; 16 2.85,-1.3; 17 2.85,-0.65; 18 2.85,0; 19 2.85,0.65; 20 2.85,1.3; 21 2.85,1.95 | smd 0.35 x 1: 8 -1.95,-2.85; 9 -1.3,-2.85; 10 -0.65,-2.85; 11 0,-2.85; 12 0.65,-2.85; 13 1.3,-2.85; 14 1.95,-2.85; 22 1.95,2.85; 23 1.3,2.85; 24 0.65,2.85; 25 0,2.85; 26 -0.65,2.85; 27 -1.3,2.85; 28 -1.95,2.85 | smd 3.7 x 3.7: EXP 0,0 | drill 0.4: P$1 0,0; P$2 -1.2,1.2; P$3 1.2,1.2; P$4 -1.2,-1.2; P$5 1.2,-1.2; P$6 0,1.2; P$7 -1.2,0; P$9 0,-1.2; P$10 1.2,0
SOT23 = smd 1 x 1.4: BOTTOM_LEFT -0.95,-1.1; BOTTOM_RIGHT 0.95,-1.1; TOP 0,1.1
IC_UMAX10 = smd 1.4 x 0.28: 1 -2.14,1; 2 -2.14,0.5; 3 -2.14,0; 4 -2.14,-0.5; 5 -2.14,-1; 6 2.14,-1; 7 2.14,-0.5; 8 2.14,0; 9 2.14,0.5; 10 2.14,1
R0805 = smd 1.3 x 1.5: 1 -0.95,0; 2 0.95,0
SOT23' = smd 1 x 1.4: 1 -0.95,-1.1; 2 0.95,-1.1; 3 0,1.1
R0402 = smd 0.6 x 0.7: 1 -0.55,0; 2 0.55,0
R_BOURNS_CAY16-J4 = smd 0.7 x 0.7: 1 -1.2,-0.725; 1A -1.2,0.725; 4 1.2,-0.725; 4A 1.2,0.725 | smd 0.45 x 0.7: 2 -0.4,-0.725; 2A -0.4,0.725; 3 0.4,-0.725; 3A 0.4,0.725
XTAL_MURATA_3-PIN-RES = smd 0.8 x 1.9: 1 -1.5,0; 2 1.5,0; GND 0,0

### Placement (x,y rotation side)
C1  73.42,22.85 270 bottom
C2  73.42,25.51 270 bottom
C3  63.52,13.79 0 bottom
C4  8.7,29.6 270 bottom
C5  2.6,19.16 0 bottom
C6  71.85,19.5 180 bottom
C7  65.6,19.95 90 bottom
C8  67.7,12.1 270 bottom
C9  55.9,29.2 0 bottom
C10  55.9,23.2 0 bottom
C11  55.9,25.2 0 bottom
C12  55.9,27.2 0 bottom
C13  73.42,28.01 90 bottom
C14  66.4,28.38 90 bottom
C15  42.43,28.4 270 bottom
C16  52.35,27.9 90 bottom
C17  44.66,22.5 0 bottom
C18  35.05,26.1 180 bottom
C19  38.1,23.04 270 bottom
C20  42.5,7.5 0 bottom
C21  52.95,16.25 180 bottom
C22  47.76,13.97 270 bottom
C23  47.47,16.1 90 bottom
C24  44.95,16.07 180 bottom
C25  49.1,11.48 180 bottom
C26  45.65,7.5 180 bottom
C27  37.6,15.95 90 bottom
C28  34.23,15.4 90 bottom
C29  34.45,13.29 0 bottom
C30  48.4,8.88 180 bottom
C31  40.3,7.5 180 bottom
C32  32.6,14.92 0 bottom
C33  34.66,10.6 90 bottom
C34  31.75,23.65 0 bottom
C35  62.5,19.25 0 bottom
C36  59.4,27.5 90 bottom
C37  20.55,17.8 270 bottom
C38  25.63,17.8 270 bottom
C39  40.7,29.25 270 bottom
C40  9.6,25.9 270 bottom
C41  9.6,23.8 270 bottom
C42  9.6,21.7 90 bottom
C43  12.85,10.4 270 bottom
C44  15.4,10.3 270 bottom
CN1  67.51,2.9 0 top
CN2  4.3,0 0 top
CN3  0,26 90 bottom
CN4  15.47,20.6 0 top
CN5  41.2,0 0 top
CN6  17.3,0 0 top
D1  70.34,9.89 270 bottom
IC1  68.1,16.25 90 bottom
IC2  69.85,27.2 0 bottom
IC3  62.9,26.4 0 bottom
IC4  47,26.5 180 bottom
IC5  59.15,24.4 0 bottom
IC6  11.9,24.3 270 bottom
L1  63.4,22.4 0 bottom
L2  22.65,23.8 270 bottom
L3  24.75,23.8 270 bottom
L4  10.8,29.6 270 bottom
L5  10.1,17.8 270 bottom
L6  12.4,17.8 270 bottom
Q1  [SOT23']  28.2,27.3 270 bottom
Q2  [SOT23']  28.2,23.1 90 bottom
R1  67.8,8.9 180 bottom
R2  67.8,10.2 180 bottom
R3  63.5,14.85 180 bottom
R4  63.5,15.9 180 bottom
R5  63.5,17.15 180 bottom
R6  63.5,18.2 180 bottom
R7  65.05,12.4 90 bottom
R8  69.35,12.42 0 bottom
R9  70.15,20.55 90 bottom
R10  69.1,20.55 90 bottom
R11  67.9,20.55 90 bottom
R12  66.85,20.55 90 bottom
R13  71.1,23.45 180 bottom
R14  66.4,25.45 90 bottom
R15  47.3,22.5 180 bottom
R16  42.16,22.5 180 bottom
R17  39.9,22.5 180 bottom
R18  52.31,22.2 180 bottom
R19  53.57,17.8 270 bottom
R20  51.03,17.8 270 bottom
R21  48.49,17.8 270 bottom
R22  45.95,17.8 270 bottom
R23  44.1,6.6 90 bottom
R24  57.38,17.8 270 bottom
R25  56.11,17.8 270 bottom
R26  40.87,17.8 270 bottom
R27  35.79,17.8 270 bottom
R28  38.33,17.8 270 bottom
R29  58.82,17.8 270 bottom
R30  30.71,17.8 270 bottom
R31  33.25,17.8 270 bottom
R32  43.41,17.8 270 bottom
RN1  58.9,9.6 0 bottom
RN2  68.05,23.15 180 bottom
RN3  35.55,23.54 180 bottom
RN4  31.8,25.8 90 bottom
X1  72.69,15.74 90 bottom

### Tracks (layer width: path | path; a pad name or v marks a point on that pad's centre or on a via)
5V_IN
  Bottom 0.406: L1.1 64.35,21.22 CN4.P$20
  Bottom 0.61: C35.1 63.05,19.92 CN4.P$20
232_FROM_P3
  Bottom 0.61: C44.1 CN6.3 14.46,13.6 13.8,13.6 12.4,15 L6.2
232_RXD
  Bottom 0.406: L3.2 24.75,21.48 CN4.P$5 C38.1
232_TO_P3
  Bottom 0.61: C43.1 CN6.1 10.1,15.43 L5.2
232_TXD
  Bottom 0.406: L2.2 22.65,22.7 CN4.P$3 C37.1
!MCLR
  Bottom 0.152: 41.6,24.1 44.25,24.1 44.7,23 44.7,22.7 44.9,22.5 C17.1
  Bottom 0.254: C17.1 R15.1 46.35,22.9 IC4.26 | 41.6,24.1 41.3,24.1 40.85,24.55 38.3,24.55 37.9,24.95 37.9,26.2 37.75,26.35 37.25,26.35
  Bottom 1.016: 37.25,26.35 37.2,26.35
+3V3  (via drill 0.4)
  Top 0.254: 66.4,28.2 v64.6,28.2 v60.5,28.2 60.5,29.3 59.9,29.9 45.85,29.9 45.4,29.45 v44.05,29.45 43.2,30.3 35.05,30.3 34.5,29.75 34.5,24.95 v33.3,23.75 | v73.42,26.7 73.4,26.72 73.4,27.6 72.1,28.9 v71.75,28.9 67.9,28.9 67.2,28.2 66.4,28.2 | v66.45,26.9 66.45,28.15 66.4,28.2
  Bottom 0.152: R15.2 47,23.3 | 46.35,29.65 46.35,28.65 46.3,28.6 45.1,28.6 44.9,28.4 44.9,24.7 45.2,24.4 46.85,24.4 47,24.2 IC4.25 | 66.25,19.3 66.55,19.3 66.85,19 IC1.18 | 66.25,19.3 65.9,19.3 | 71.25,18.05 71.25,18.75 71.2,18.8 | IC1.14 65.15,17 64.65,16.5 63.5,16.5 | 63.5,16.5 63.5,14.31 C3.1 | 63.5,16.5 63.5,18.7 63.6,18.8 65.5,18.8 65.6,18.9 C7.1 | IC1.22 68.85,19.15 68.5,19.5 68.5,20.5 68.55,20.55 | 68.55,20.55 66.25,20.55 66.2,20.5 66.2,19.35 66.25,19.3 | 68.55,20.55 71.1,20.55 71.25,20.4 | R7.1 66.85,11.85 67.1,12.1 68.48,12.1 R8.2 | 58.6,27.5 60,27.5 60.1,27.6
  Bottom 0.254: IC3.10 60.1,26.07 | IC3.8 61.85,24.6 60.7,24.6 60.1,25.2 60.1,25.4 | IC3.9 60.12,25.43 60.1,25.4 | 60.1,26.07 60.1,27.6 60.1,27.8 v60.5,28.2 | C13.1 v73.42,26.7 C2.1 72.86,26.01 72.5,25.65 72.5,23.55 72.4,23.45 | IC4.10 46.35,29.65 | 58.6,27.5 58.35,27.25 58.35,24.7 58.2,24.55 IC5.BOTTOM_RIGHT 58.2,22.95 57.2,21.95 54.15,21.95 53.9,22.2 53.9,22.8 53.2,23.5 50.8,23.5 49.8,22.5 R15.2 | v44.05,29.45 42.83,29.45 C15.1 | 47,23.6 IC4.25 47,23.3 | IC3.1 64.78,28.02 v64.6,28.2 | 66.39,26.96 66.35,27 66.35,27.69 C14.1 66.39,26.96 | 66.39,26.96 v66.45,26.9 66.47,26.88 IC2.10 66.53,26.88 66.45,26.8 66.45,26.05 R14.2 | IC2.9 66.62,26.23 R14.2 | IC2.8 68.88,25.52 68.9,25.55 66.85,25.55 R14.2 | 73.05,23.45 73.35,23.45 C1.1 73.37,23.45 72.5,23.45 | IC1.26 71.25,17.5 71.25,18 | 71.25,18 71.25,18.05 | 71.25,18.05 71.2,18 IC1.25 71.25,18 | 65.9,19.3 65.7,19.3 | 65.7,19.3 65.45,19.3 | R13.2 72.4,23.45 | 71.25,18.05 71.25,19.45 | 71.25,19.45 71.25,20.4 71.45,20.4 72.5,21.45 72.5,23.45 | C3.1 64.18,13.85 64,13.7 63.95,13.7 | 68.8,12.25 68.85,12.3 68.8,12.35 68.8,12.4 | 68.85,13.93 IC1.3 68.85,12.47 R8.2 68.8,12.4 | v71.75,28.9 71.75,28.2 IC2.1 | 68.85,12.45 68.8,12.4 | C6.1 71.25,19.45 | C7.1 65.7,19.3 | IC1.10 65.05,15 64.85,14.8 64.85,14.05 64.6,13.8 64.03,13.8 C3.1 | 72.4,23.45 72.5,23.45 | R7.1 64.25,11.85 64,12.1 64,13.77 C3.1 | 60.1,26.07 60.1,25.4 | RN4.1A 32.52,23.48 C34.1 32.4,23.75 v33.3,23.75
  Bottom 0.406: C39.1 43.3,30.2 v44.05,29.45
+5V  (via drill 0.4)
  Top 0.254: v32.5,30.9 32.5,27.3 v33.6,26.2
  Bottom 0.254: 59.27,22.18 58.6,21.5 53.66,21.5 R18.2 52.96,22.84 52.8,23 51,23 50.8,22.8 50.8,22.4 50.1,21.7 43.71,21.7 R16.2 42.01,23.4 40.9,23.4 40.5,23.8 38.21,23.8 C19.1 37.91,23.5 36.25,23.5 35.95,23.8 RN3.3 35.95,25.05 35.9,25.1 35.2,25.1 | IC5.TOP 59.2,25.55 59.2,26.3 59.4,26.5 C36.1 | RN3.1 34.35,25.1 | 35.2,25.1 34.35,25.1 | RN3.2 35.15,25.05 35.2,25.1 | 34.35,25.1 34.35,25.95 C18.1 34.4,26.2 v33.6,26.2 RN4.3A
  Bottom 0.406: L1.2 61.8,22 59.45,22 59.27,22.18 59.15,22.3 IC5.TOP | CN3.1 2.9,24.7 2.8,24.8
  Bottom 0.61: CN2.1 3.55,17.23 C5.1 3.55,22.55 2.8,23.3 2.8,24.8 2.8,28.8 3.8,29.8 3.8,30.7 4.7,31.6 7.65,31.6 C4.1 L4.1 14.05,30.55 14.7,31.2 32.2,31.2 v32.5,30.9
ACC_ALC
  Bottom 0.254: 43.5,20.6 CN4.P$12 42.41,21.6 42,21.6 41.51,22.09 R16.1 R17.2
  Bottom 0.813: CN4.P$12 R32.1
ACC_AUX
  Bottom 0.813: CN4.P$15 R20.1
ACC_BND0
  Bottom 0.254: CN4.P$7 30.71,20.71 32,22 34.1,22 34.35,22.25 RN3.1A
  Bottom 0.813: CN4.P$7 R30.1
ACC_BND1
  Bottom 0.254: R18.1 51.2,22.2 50.2,21.2 48.8,21.2 48.49,20.89 CN4.P$14
  Bottom 0.813: CN4.P$14 R21.1
ACC_BND2
  Bottom 0.254: RN3.3A 35.95,21.85 35.8,21.7 CN4.P$9
  Bottom 0.813: CN4.P$9 R27.1
ACC_BND3
  Bottom 0.254: CN4.P$8 33.25,21.15 33.6,21.5 34.8,21.5 35.15,21.85 RN3.2A
  Bottom 0.813: R31.1 CN4.P$8
ACC_COMMON
  Top 0.406: CN5.12 43.49,9.31 42.7,10.1 39.6,10.1 38.9,10.8 38.9,12.2 38,13.1 37.49,13.1 CN5.5
  Bottom 0.406: CN5.12 43.05,8.45 C20.1 43.75,7.5 R23.2
ACC_DI0
  Bottom 0.813: CN4.P$16 R19.1
ACC_DI1
  Bottom 0.813: CN4.P$17 R25.1
ACC_DO0
  Bottom 0.61: CN4.P$18 58.65,19.95 57.38,18.68 R24.1
ACC_DO1
  Bottom 0.61: R29.1 59.85,18.35 61.19,19.69 CN4.P$19
ACC_KEY
  Bottom 0.813: CN4.P$10 R28.1
ACC_PTT
  Bottom 0.813: CN4.P$13 R22.1
ACC_PWR
  Bottom 0.813: CN4.P$11 R26.1
AGND  (via drill 0.4)
  Bottom 0.254: 33.65,11.25 v33.8,12.25
  other vias: 32,16.3 39.45,17 36.25,15.15 34.45,17 54.55,16.85 46.75,13.3 46.4,16.15 42.3,8.5 45.8,10.4 41.3,15.3 41.6,12.3 42.3,13.7 57.2,13.8 50,8.9 49,7.8 50,12.5 48.8,10.6
  pour Top: 8.8,17.3 59.3,17.3 59.3,16.4 57.8,16.4 57.8,12.6 54.7,12.6 54.7,9.9 51.7,7.2 8.8,7.2
  pour Bottom: 8.8,17.3 59.3,17.3 59.3,16.4 57.8,16.4 57.8,12.6 54.7,12.6 54.7,9.9 51.7,7.2 8.8,7.2
ALC_X
  Bottom 0.254: R32.2 43.41,16.81 43.1,16.5 40.7,16.5 39.15,14.95 38.3,14.95 38,14.65 38,13.4 38.4,13 42.7,13 43.3,12.4 43.3,10.6 42.6,9.9 37.6,9.9 36.62,8.92 CN5.15 35.46,10.05 C33.1
ASDF
  Bottom 0.254: Q1.3 30.2,27.3 30.35,27.15 30.35,26.35 30.5,26.2 RN4.3
  Bottom 0.406: Q1.3 23.6,27.3 22.65,26.35 L2.1
AUX_X
  Bottom 0.254: 47.75,14.9 48.8,14.9 49.8,15.9 49.8,16.9 50.15,17.25 R20.2 | 47.75,14.9 44.42,14.9 CN5.2 | C22.1 47.76,14.89 47.75,14.9
BND0_X
  Bottom 0.254: R30.2 30.71,14.64 32.6,12.75 32.6,10.15 35.4,7.35 39.66,7.35 39.8,7.5 39.8,8.15 39.95,8.3 40.61,8.3 CN5.13
  Bottom 0.406: C31.1 39.8,7.5
BND1_X
  Bottom 0.254: 47.55,15.4 47.7,15.4 48.49,16.19 R21.2 | 47.55,15.4 42.63,15.4 CN5.3 | C23.1 47.47,15.48 47.55,15.4
BND2_X
  Bottom 0.152: 36.45,10.4 34.6,12.2 34.45,12.35 34.45,14 34.23,14.22
  Bottom 0.254: CN5.9 40.05,10.86 39.6,10.4 36.45,10.4 | R27.2 35.79,16.41 C28.1 34.23,14.22
BND3_X
  Bottom 0.254: CN5.14 37.92,7.9 35.7,7.9 33.1,10.5 33.1,14.9 | 33.1,14.9 33.1,17.1 R31.2 | C32.1 33.12,14.92 33.1,14.9
D+_P
  Bottom 0.254: R1.1 67.25,7.74 CN1.3
DIG0_X
  Bottom 0.152: CN5.1 48.72,13.97
  Bottom 0.254: 48.72,13.97 51.1,16.35 51.9,16.35 52.02,16.48 | R19.2 52.8,17.25 52.02,16.48 | C21.1 52.3,16.2 52.02,16.48
DIG1_X
  Bottom 0.254: R25.2 56.11,17.21 54.84,15.94 54.45,15.6 51.45,15.6 48.45,12.6 45.8,12.6 CN5.7 44.55,11.35 44.55,8.05 C26.1
DIGO1_X
  Bottom 0.254: CN5.11 46.74,8.89 46.75,8.88 C30.1 47.85,9.55 48.2,9.9 50.1,9.9 50.7,10.5 50.7,12.85 52.4,14.55 56,14.55 57.9,16.45 58.55,16.45 58.8,16.7 58.8,17.23 R29.2
DIGO_X
  Bottom 0.254: R24.2 55.23,15.1 51.6,15.1 48.55,12.05 C25.1 46.98,11.48 CN5.6
DM0
  Bottom 0.152: IC1.2 69.35,11.9
  Bottom 0.254: R2.2 68.56,10.39 D1.6 D1.1 71.44,10.39 71.8,10.65 71.8,11.45 71.55,11.7 69.55,11.7 69.35,11.9
DM1
  Bottom 0.152: R3.1 61.9,14.85 61,13.95 61,11.85 60.1,10.95 RN1.1A 60.42,10.32 61.2,9.55 61.2,7.7 57.5,4 56.2,4 53.8,1.6 4.9,1.6 4.5,2 4.5,3.8 3.4,4.9 3.4,9.1 2.9,9.6 2.9,13.08 CN2.2
DM2
  Bottom 0.152: R5.1 61.75,17.15 59.4,14.8 59.4,11.65 58.5,10.9 RN1.3A 58.5,9.75 58.4,9.65 57.1,9.65 57,9.55 57,6.1 56.4,5.5 55.5,5.5 53.3,3.3 6.3,3.3 6,3.6 6,4.6 5.3,5.3 5.3,20.7 5.9,21.3 7.4,21.3 7.6,21.5 7.6,25.1 7.35,25.35 CN3.2
DM3
  Bottom 0.152: IC3.7 62.58,23.57 62.75,23.4 65.6,23.4 66.67,22.32 RN2.1A
  Bottom 0.254: 66.67,22.32 66.67,21.27 R12.2
DM4
  Bottom 0.152: RN2.3A 68.45,22.8 68.75,23.1 69.7,23.1 69.9,23.3 69.9,24.3 69.55,24.65 69.55,25.3 IC2.7
  Bottom 0.254: RN2.3A 68.45,22.1 69.1,21.45 R10.2
DP0
  Bottom 0.254: R1.2 69,8.9 69.49,9.39 D1.4 D1.3 71.56,9.39 71.7,9.25 72.45,9.25 72.75,9.55 72.75,10.25 72.3,10.7 72.3,11.75 71.63,12.42 R8.1 | 69.85,12.37 R8.1 | IC1.1 69.85,12.47 R8.1
DP1
  Bottom 0.152: 62.85,16 R4.1 62.45,15.9 60.65,14.1 60.65,12 59.3,10.65 RN1.2A 59.3,9.8 59.4,9.7 60.5,9.7 60.8,9.4 60.8,7.8 57.4,4.4 56.1,4.4 53.7,2 5.1,2 4.9,2.2 4.9,3.9 3.75,5.05 3.75,9.25 3.3,9.7 3.3,11.38 CN2.3
DP2
  Bottom 0.152: R6.1 62.3,18.2 59.05,14.95 59.05,12 57.7,10.8 RN1.4A 57.33,10.32 56.65,9.65 56.65,6.35 56.2,5.9 55.4,5.9 53.2,3.7 6.5,3.7 6.4,3.8 6.4,4.8 5.7,5.5 5.7,20.6 6,20.9 7.6,20.9 8,21.3 8,25.7 7.7,26 CN3.3
DP3
  Bottom 0.152: IC3.6 63.23,23.82 63.3,23.75 64.85,23.75 | RN2.2A 67.65,22.85 67.4,23.1 66.35,23.1 65.7,23.75 64.85,23.75 | 64.85,23.75 64.8,23.8 64.8,24.65 65.1,24.95 66.35,24.95 R14.1
  Bottom 0.254: RN2.2A 67.65,21.9 67.9,21.65 R11.2
DP4
  Bottom 0.152: RN2.4A 69.53,22.32 70.35,23.15 70.35,23.4 | 70.35,23.4 70.35,24.4 70.2,24.55 70.2,25.3 IC2.6 | R13.1 70.4,23.45 70.35,23.4
  Bottom 0.254: R9.2 70.15,21.52 RN2.4A
GND  (via drill 0.4)
  Bottom 0.152: IC4.P$4 45.8,27.2 45.75,27.15 | IC2.13 68.88,29.02
  Bottom 0.254: IC1.31 68.85,15 68.8,15.05 68.8,15.55 68.45,15.9 | 68.45,15.9 IC1.EXP | IC1.28 69.05,16.5 68.45,15.9 | IC1.6 67.35,14.95 | 67.35,14.95 67.35,15.1 67.4,15.15 67.7,15.15 68.45,15.9 | IC1.7 66.85,14.9 v66.8,14.95 67.35,14.95 | IC3.3 63.6,26.09 63.23,26.09 IC3.TAB 62.9,26.3 62.1,27.1 62.1,27.3 61.92,27.48 IC3.13 | IC4.24 47.65,24.75 IC4.P$3 | C2.2 75.26,25.01 75.2,25.3 75.2,27.01 | v42.88,23.5 43.48,23.33 | C18.2 35.6,25.6 | 36.29,25.4 v37.14,25.25 | IC2.3 70.72,26.88 IC2.P$1 | IC2.P$4 IC2.TAB | 68.88,29.02 68.88,28.18 IC2.P$3 | IC1.27 69.55,17 69.35,16.8 69.35,16.3 v69.4,16.25
  Bottom 0.406: IC3.P$3 62.25,27 | IC3.P$4 62.9,27 IC3.TAB 62.9,25.8 IC3.P$2 | IC3.P$1 63.6,25.8 63.6,26.09 | C13.2 73.4,28.66 73.4,30.9 72.13,30.9
  Bottom 0.61: CN6.5 17.93,19.14 15.3,18.9
  other vias: 71.95,13 73.45,12.95 73.4,18.45 68.1,16.25 66.8,16.25 66.8,17.55 68.1,17.55 69.4,17.55 68.1,14.95 69.4,14.95 74.35,15.7 72.1,9.9 72.1,18.45 65.3,4.9 29.44,20 31.98,20 34.52,20 37.06,20 39.6,20 42.14,20 44.68,20 47.22,20 49.76,20 52.3,20 54.84,20 57.38,20 59.92,20 65.55,13.8 56.75,24.2 61.25,23.8 61.25,22.8 58.55,28.15 54.2,29.2 50.7,29.1 55.95,26.2 56.85,26.2 67.8,24.85 66.65,11.2 65.6,24.35 70.6,18.8 71.15,21.25 68.8,11.2 64.95,10.2 65.65,22.45 65.65,21.5 66.35,12.9 61.42,18.25 62.42,20.6 60.05,12.45 62,16.45 61.85,13.8 61.35,11.3 60.7,15.15 73.15,11 73.4,9.15 70.5,22.4 71.8,22.4 73.4,21.25 27.09,25.3 71.72,24.8 27.89,26.2 71.1,11.05 64.85,8.75 69.8,8.65 57.72,7.95 60.1,7.95 26.79,21.1 33.79,27.1 33.54,25.25 32.09,22.75 5.54,0.9 8.54,0.9 11.54,0.9 14.54,0.9 17.54,0.9 20.54,0.9 23.54,0.9 26.54,0.9 5.54,2.7 8.54,2.7 11.54,2.7 14.54,2.7 17.54,2.7 20.54,2.7 23.54,2.7 26.54,2.7 29.54,2.7 32.54,2.7 35.54,2.7 38.54,2.7 41.54,2.7 44.54,2.7 47.54,2.7 50.54,2.7 29.54,0.9 32.54,0.9 35.54,0.9 38.54,0.9 41.54,0.9 44.54,0.9 47.54,0.9 50.54,0.9 4.14,1.3 4.64,5.1 53.54,2.7 53.54,0.9 55.09,4.25 56.99,5.1 58.44,6.45 59.71,5.18 56.04,2.8 58.34,3.9 3.74,2.7 2.74,5.1 2.74,8.1 4.64,8.1 2.24,11.6 2.24,13.3 1.04,20.7 6.34,11.6 6.34,14 4.59,17.9 6.44,18.6 6.44,20.2 8.24,20.6 8.64,22 8.64,23.9 8.44,26.3 7.24,26.7 4.64,20.9 6.94,24.6 8.54,4.5 14.54,4.5 17.54,4.5 20.54,4.5 26.54,4.5 29.54,4.5 32.54,4.5 35.54,4.5 38.54,4.5 41.54,4.5 44.54,4.5 47.54,4.5 50.54,4.5 53.14,4.6 54.69,6.25 55.99,7 55.99,8.6 6.44,8.1 6.44,6.3 31.69,28.9 11.54,24 10.64,25.2 33.79,28.9 35.19,28.9 12.69,29.4 33.79,30.9
  pour Bottom: 69.55,8.9 69.6,5.9 65.5,5.9 65.6,8.85
  pour Top (no thermals): 45.2,28.3 48.8,28.3 48.8,24.7 45.2,24.7
  pour Top (no thermals): 68.75,28.35 71.1,28.35 71.1,26.05 68.7,26.05 68.7,28.35
  pour Top (no thermals): 61.7,27.6 64.1,27.6 64.1,25.25 61.7,25.25
  pour Top: -1.55,34.45 78.65,34.45 78.65,-1.95 -1.9,-1.95 -0.4,6.05 53.1,6.05 56.2,9.2 57,10 57,10.95 58.55,12.35 58.55,15.75 59.95,15.75 59.95,18.3 -1.55,18.3
  pour Bottom: -1.55,34.45 78.65,34.45 78.65,-1.95 -1.9,-1.95 -0.4,6.05 53.1,6.05 56.2,9.2 57,10 57,10.95 58.55,12.35 58.55,15.75 59.95,15.75 59.95,18.3 -1.55,18.3
  pour Bottom: 7.9,4.7 -2.2,4.8 -2.2,19.2 4.4,19.2 7.9,18.6
  pour Top: 7.85,4.4 -2.1,4.5 -2.1,18.9 7.85,18.8
KEY_X
  Bottom 0.254: CN5.10 36.45,11.43 | 36.45,11.43 36.27,11.43 35.2,12.5 | 35.2,12.5 35.2,13.3 | 35.2,13.3 35.2,15.19 37.26,17.25 R28.2 | 36.46,11.44 36.45,11.43 | 35.19,12.49 35.2,12.5 | C29.1 35.19,13.29 35.2,13.3
N$1
  Bottom 0.152: R10.1 69.1,19.7 69.35,19.45 IC1.23
N$2
  Bottom 0.254: IC4.17 52.1,27.15 C16.1
N$3
  Bottom 0.152: IC1.24 69.85,19.1 70.15,19.4 R9.1
N$4
  Bottom 0.254: IC6.1 10.9,27.7 | 10.9,27.7 10.9,28.55 L4.2 | C40.1 9.6,27.1 10.2,27.7 10.9,27.7
N$6
  Bottom 0.254: IC6.2 11.4,25 10.75,24.35 C41.1
N$7
  Bottom 0.254: C41.2 11.05,23.25 11.4,22.9 IC6.9
N$8
  Bottom 0.254: IC1.30 71.05,15.5 72,14.55 72.38,14.55 X1.1
N$9
  Bottom 0.254: IC1.4 68.35,13.25 C8.1 67.1,12.65 66.7,12.25 65.75,12.25 R7.2
N$10
  Bottom 0.254: IC1.29 71.05,16 72.1,17.05 72.5,17.05 X1.2
N$11
  Bottom 0.254: IC1.15 64.95,17.5 64.6,17.15 R5.2
N$12
  Bottom 0.254: IC1.11 64.7,15.5 R3.2
N$13
  Bottom 0.254: IC1.12 64.15,16 R4.2
N$14
  Bottom 0.254: IC1.16 64.85,18 64.65,18.2 R6.2
N$15
  Bottom 0.254: IC6.8 11.9,21.4 11.65,21.15 C42.1
N$16
  Bottom 0.152: IC1.20 67.85,19.95 R11.1
N$17
  Bottom 0.152: R12.1 66.85,19.7 67.35,19.2 IC1.19
N$20
  Bottom 0.254: CN1.2 66.37,5.88 65.55,6.7 65.55,9.75 66,10.2 R2.1
PGC
  Bottom 0.254: IC4.19 50.7,25.85 51.45,25.1 51.5,25.1
  Bottom 1.016: 51.5,25.1 51.55,25.1
PGD
  Bottom 0.254: IC4.18 50.7,26.5 51.25,25.95 52.35,25.95 53.15,25.15
  Bottom 1.016: 53.15,25.15 53.2,25.15
PTT_X
  Bottom 0.254: CN5.4 40.94,16 44.58,16 C24.1 44.4,16.85 44.8,17.25 R22.2
PWR_X
  Bottom 0.254: CN5.8 41.47,11.43 40.5,12.4 37.9,12.4 37.5,12.8 37.5,15.1 | 37.5,15.1 37.5,15.2 37.65,15.2 37.85,15.4 38.9,15.4 40.75,17.25 R26.2 | C27.1 37.5,15.1
SADF
  Bottom 0.254: L3.1 25.5,24.85 26,24.35 26,22.6 26.45,22.15 Q2.1 28,22.15 28.2,22.35 28.2,23.65 29.95,25.4 RN4.2
UART_FROM_CAT
  Bottom 0.152: IC4.14 48.95,29.45 49.3,29.8 53.5,29.8 53.6,29.7 53.6,28.8 54,28.4 55.75,28.4 C9.1 56.55,29.65 57.15,30.25 70.75,30.25 71.4,29.5 72,29.5 72.7,28.8 72.7,27.65 72.58,27.52 IC2.2
  Bottom 0.254: 56.5,28.95 C9.1
UART_FROM_K3
  Bottom 0.254: IC4.1 42.25,24.55 41.8,25 39,25 38.5,25.5 38.5,26.5 37.2,27.8 31.95,27.8 31.75,27.6 31.75,24.7 31.65,24.6 RN4.1 30.15,24.6 29.3,23.75 Q2.3 | 29.6,23.4 Q2.3 | Q2.3 29.6,23.1
UART_FROM_P3
  Bottom 0.254: IC6.5 12.9,27.1 15.4,29.6 36.9,29.6 39.5,27 39.5,26.2 39.7,26 42.3,26 42.45,25.85 IC4.3
UART_FROM_WK
  Bottom 0.152: IC4.22 49.85,23.65 50.6,24.3 54.75,24.3 54.95,24.5 56.2,24.5 56.55,24.85 C11.1 57.3,25.2 57.6,25.5 57.6,28.8 58.35,29.55 64.65,29.55 65.3,28.9 65.3,28.2 65.7,27.8 65.7,26.95 65.47,26.73 IC3.2
UART_TO_CAT
  Bottom 0.152: 70.22,28.93 IC2.15 70.17,29.73 70,29.9 57.45,29.9 57.2,29.65 57.2,27.4 57,27.2 C12.1 56.55,27.75 56.3,28 54.4,28 54.3,27.9 51,27.9 50.45,28.45 IC4.15
UART_TO_K3
  Bottom 0.254: IC4.2 42.4,25.2 42.1,25.5 39.3,25.5 39,25.8 39,26.8 37.55,28.25 31.1,28.25 | Q1.1 31.1,28.25 | RN4.4 31.07,28.23 31.1,28.25
UART_TO_P3
  Bottom 0.254: IC4.4 40.7,26.5 37.1,30.1 15.2,30.1 12.4,27.3 IC6.4
UART_TO_WK
  Bottom 0.152: C10.1 57.15,23.2 57.4,23.45 57.4,24.8 57.95,25.35 57.95,28.45 58.7,29.2 63.05,29.2 63.23,29.02 IC3.15 | 54.4,22.6 54.4,23.1 53.6,23.9 50.7,23.9 49.6,22.9 48.7,22.9 48.3,23.3 IC4.23
  Bottom 0.254: C10.1 56.55,22.6 56.35,22.4 54.6,22.4 54.4,22.6
VBUS
  Bottom 0.254: CN1.1 66.25,7.52 66.25,9.35 66.44,9.54 68.99,9.54 69.34,9.89 D1.5
WTRE
  Bottom 0.254: L5.1 10.1,19.9 10.5,20.3 11.7,20.3 12.4,21 IC6.7
Y5W4
  Bottom 0.254: L6.1 12.4,19.8 12.9,20.3 IC6.6

### Text on the board
tPlace: 232_GND | 232_DTR | 232_TXD | 232_RTS | 232_RXD | ACC_GND | ACC_BD0 | ACC_BD3 | ACC_BD2 | ACC_KEY | ACC_PWR | ACC_ALC | ACC_PTT | ACC_BD1 | ACC_AUX | ACC_DI0 | ACC_DI1 | ACC_DO0 | ACC_DO1 | +5V | TX | RX | GND
bPlace: GND | !MCLR | KIO3W / MØWUT / v0.2